# Altium project OctopusPB_r0102.PrjPcb (part 1 of 2)
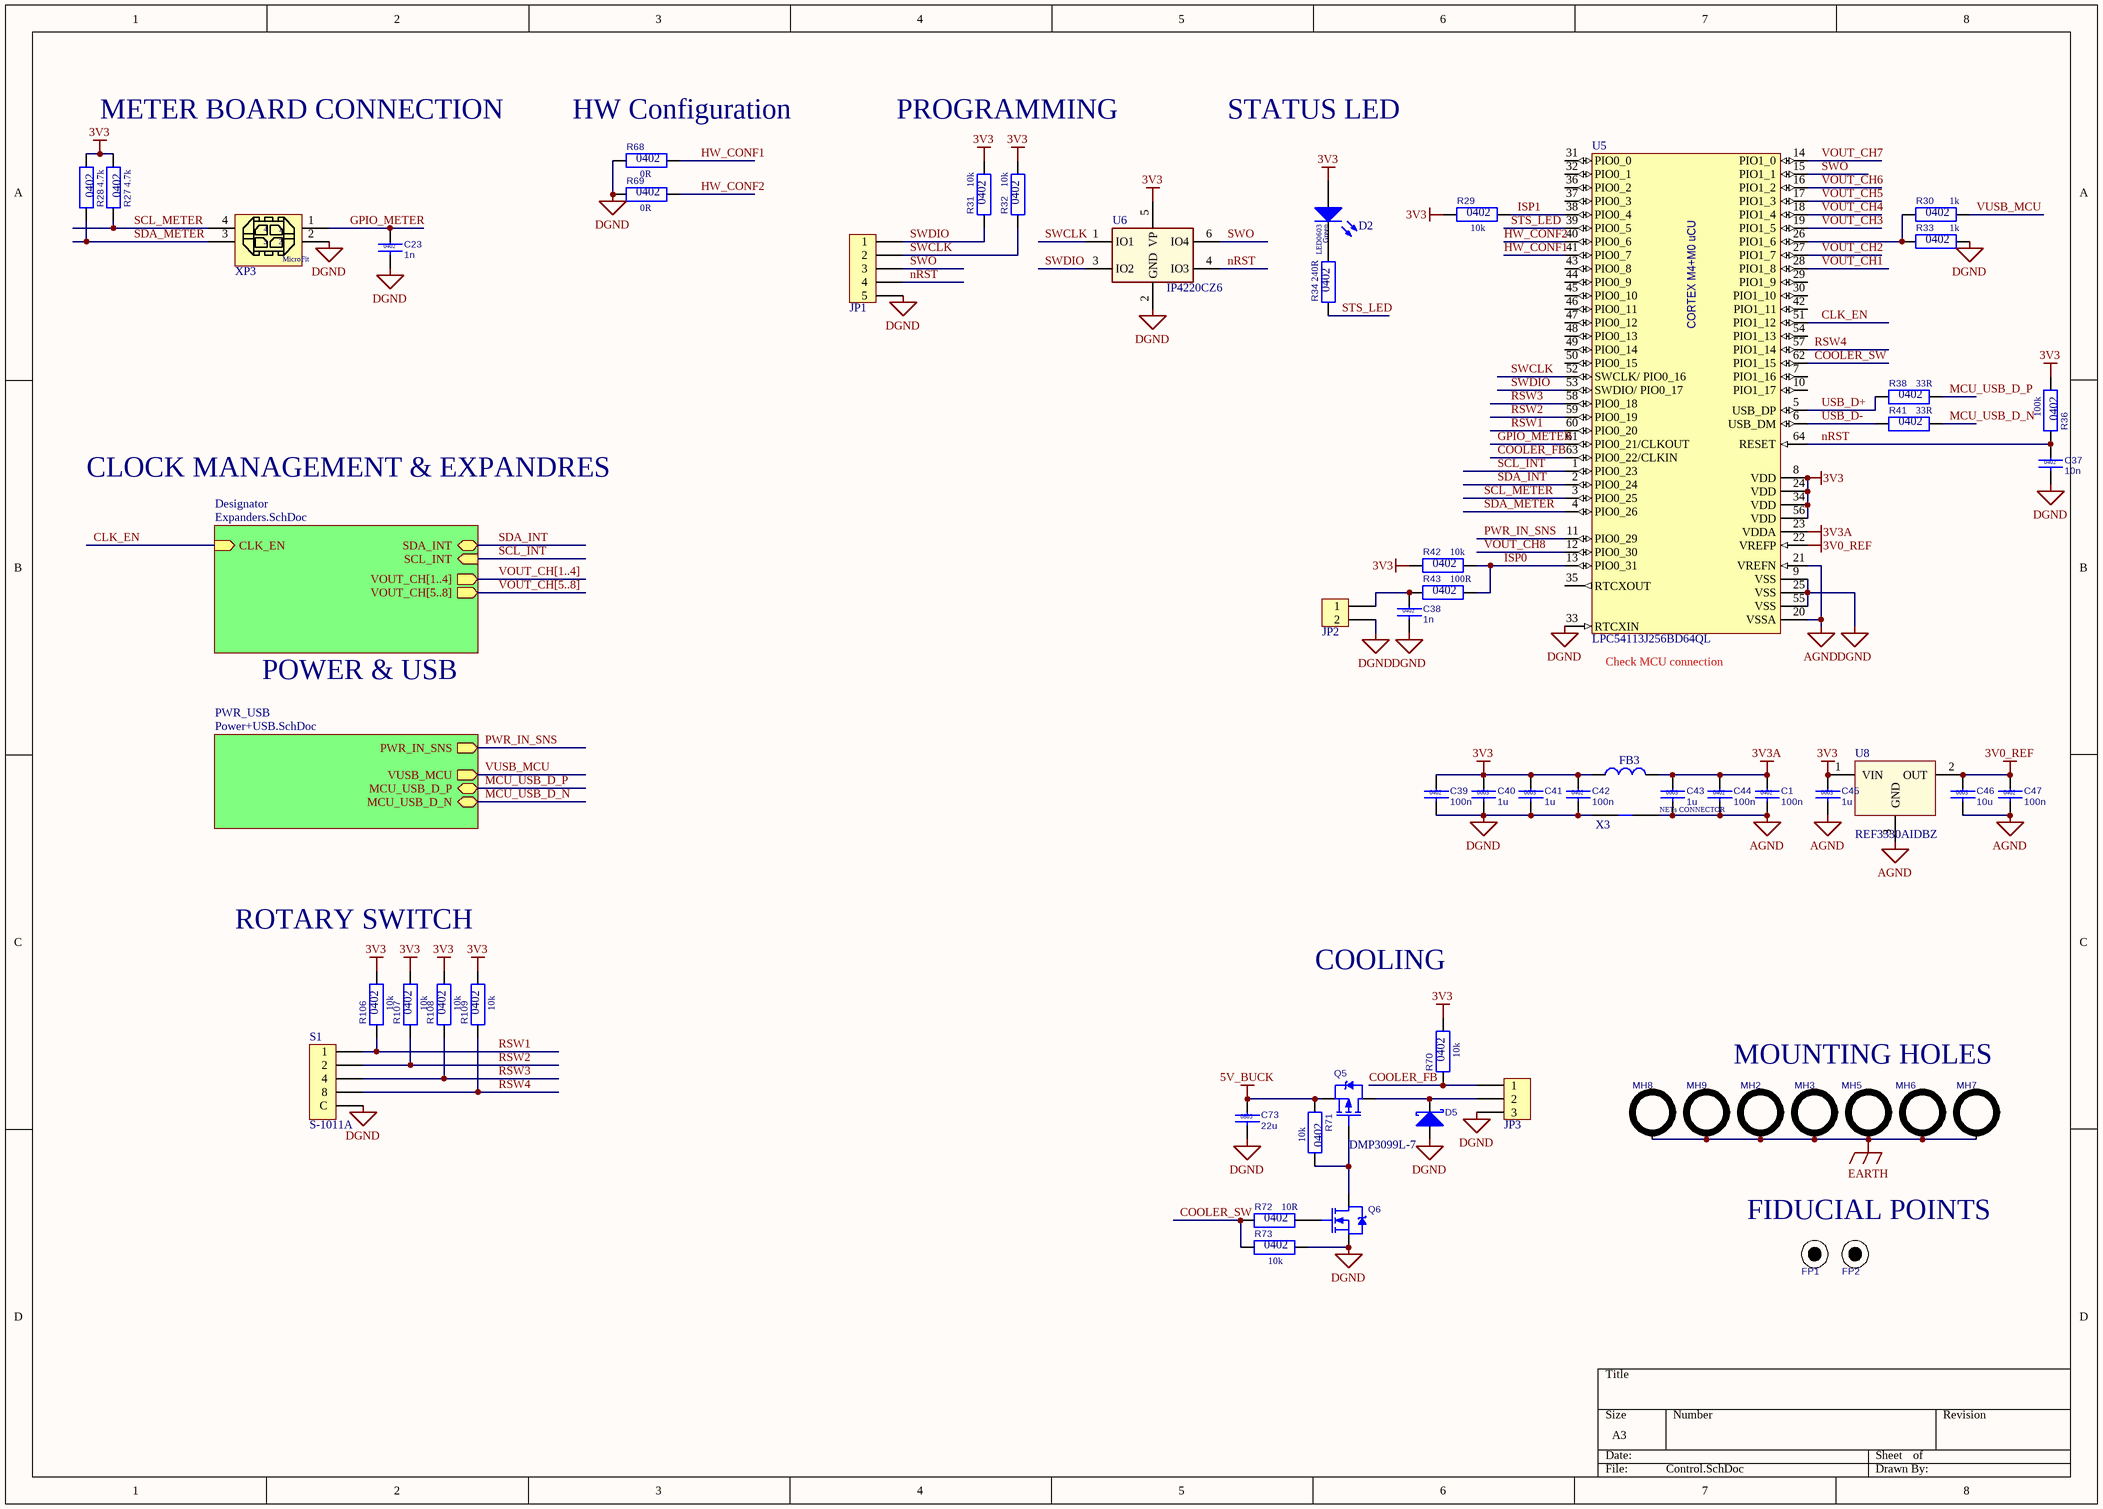
[diagram p0: Control.SchDoc]
5 sheets, 807 parts. Net scope: hierarchical (ports join the sheet entries above them; power ports are global).
Board file: OctopusPB_r0102.PcbDoc
Sheets:
  Control.SchDoc
    Designator = Expanders.SchDoc
      B1 = BuckConverter.SchDoc
      B2 = BuckConverter.SchDoc
      B3 = BuckConverter.SchDoc
      B4 = BuckConverter.SchDoc
      F1 = VoltageFeedbackSwitch.SchDoc
      B5 = BuckConverter.SchDoc
      B6 = BuckConverter.SchDoc
      B7 = BuckConverter.SchDoc
      B8 = BuckConverter.SchDoc
      F2 = VoltageFeedbackSwitch.SchDoc
    PWR_USB = Power+USB.SchDoc

## Sheet Control.SchDoc
size A3

### Parts
C1  100n  Case: 0402  [CC0402M]
C23  1n  Case: 0402  [CC0402M]
C37  10n  Case: 0402  [CC0402M]
C38  1n  Case: 0402  [CC0402M]
C39  100n  Case: 0402  [CC0402M]
C40  1u  Case: 0603  [CC0603M]
C41  1u  Case: 0603  [CC0603M]
C42  100n  Case: 0402  [CC0402M]
C43  1u  Case: 0603  [CC0603M]
C44  100n  Case: 0402  [CC0402M]
C45  1u  Case: 0603  [CC0603M]
C46  10u  Case: 0603  [CC0603M]
C47  100n  Case: 0402  [CC0402M]
C73  22u  Case: 0805  [CC0805M]
D2  Color: Green  [LED0603]  (hidden comment: 150060GS75000)
D5  BAT54HT1G  [SOD323]  (value not drawn)
FB3  BLM18HG102SN1D  [FB0603M]  (value not drawn)
FP1  FP  [FP]  (value not drawn)  (no BOM)
FP2  FP  [FP]  (value not drawn)  (no BOM)
JP1  HEADER-2.54-THR-1x5-MV  [HEADER-2.54-THR-1x5-MV]  (value not drawn)
JP2  HEADER-2.54-THR-1x2-MV  [HEADER-2.54-THR-1x2-MV]  (value not drawn)
JP3  HEADER-2.54-THR-1x3-MV  [HEADER-2.54-THR-1x3-MV]  (value not drawn)
MH2  MH-3.5-PLATED  [MH_3.5_PLATED]  (value not drawn)  (no BOM)
MH3  MH-3.5-PLATED  [MH_3.5_PLATED]  (value not drawn)  (no BOM)
MH5  MH-3.5-PLATED  [MH_3.5_PLATED]  (value not drawn)  (no BOM)
MH6  MH-3.5-PLATED  [MH_3.5_PLATED]  (value not drawn)  (no BOM)
MH7  MH-3.5-PLATED  [MH_3.5_PLATED]  (value not drawn)  (no BOM)
MH8  MH-3.5-PLATED  [MH_3.5_PLATED]  (value not drawn)  (no BOM)
MH9  MH-3.5-PLATED  [MH_3.5_PLATED]  (value not drawn)  (no BOM)
Q5  DMP3099L-7  [SOT23-3]
Q6  NX3020NAKW,115  [SOT323]  (value not drawn)
R27  Case: 0402  [RC0402M]  (hidden comment: 4.7k)
R28  Case: 0402  [RC0402M]  (hidden comment: 4.7k)
R29  Case: 0402  [RC0402M]  (hidden comment: 10k)
R30  Case: 0402  [RC0402M]  (hidden comment: 1k)
R31  Case: 0402  [RC0402M]  (hidden comment: 10k)
R32  Case: 0402  [RC0402M]  (hidden comment: 10k)
R33  Case: 0402  [RC0402M]  (hidden comment: 1k)
R34  Case: 0402  [RC0402M]  (hidden comment: 240R)
R36  Case: 0402  [RC0402M]  (hidden comment: 100k)
R38  Case: 0402  [RC0402M]  (hidden comment: 33R)
R41  Case: 0402  [RC0402M]  (hidden comment: 33R)
R42  Case: 0402  [RC0402M]  (hidden comment: 10k)
R43  Case: 0402  [RC0402M]  (hidden comment: 100R)
R68  Case: 0402  [RC0402M]  (hidden comment: 0R)
R69  Case: 0402  [RC0402M]  (hidden comment: 0R)
R70  Case: 0402  [RC0402M]  (hidden comment: 10k)
R71  Case: 0402  [RC0402M]  (hidden comment: 10k)
R72  Case: 0402  [RC0402M]  (hidden comment: 10R)
R73  Case: 0402  [RC0402M]  (hidden comment: 10k)
R106  Case: 0402  [RC0402M]  (hidden comment: 10k)
R107  Case: 0402  [RC0402M]  (hidden comment: 10k)
R108  Case: 0402  [RC0402M]  (hidden comment: 10k)
R109  Case: 0402  [RC0402M]  (hidden comment: 10k)
S1  S-1011A  [S-1011A]
U5  LPC54113J256BD64QL  [LQFP-64]
U6  IP4220CZ6  [TSOP-6]
U8  REF3330AIDBZ  [SOT23-3]
X3  NETs_CONNECTOR  [NETs_CONNECTOR]  (value not drawn)  (no BOM)
XP3  0447690401  [0447690401]  (value not drawn)

### Sub-sheets
Designator = Expanders.SchDoc: SDA_INT (bidir), SCL_INT (in), VOUT_CH[5..8] (out), CLK_EN (in), VOUT_CH[1..4] (out)
PWR_USB = Power+USB.SchDoc: PWR_IN_SNS (out), MCU_USB_D_N (bidir), MCU_USB_D_P (bidir), VUSB_MCU (out)

### Nets
3V0_REF: C46.1 C47.1 U5.22(VREFP) U8.2(OUT)
3V3: C39.1 C40.1 C41.1 C42.1 C45.1 D2.2(A) FB3.1 R27.2 R28.2 R29.1 R31.2 R32.2 R36.2 R42.1 R70.2 R106.2 R107.2 R108.2 R109.2 U5.8(VDD) U5.24(VDD) U5.34(VDD) U5.56(VDD) U6.5(VP) U8.1(VIN)
3V3A: C1.1 C43.1 C44.1 FB3.2 U5.23(VDDA)
5V_BUCK: C73.1 Q5.2(S) R71.1
AGND: C1.2 C43.2 C44.2 C45.2 C46.2 C47.2 U5.20(VSSA) U5.21(VREFN) U8.3(GND) X3.1
DGND: C23.2 C37.2 C38.2 C39.2 C40.2 C41.2 C42.2 C73.2 D5.2(A) JP1.5 JP2.2 JP3.3 Q6.2(S) R33.2 R68.1 R69.1 R73.2 S1.C U5.9(VSS) U5.25(VSS) U5.33(RTCXIN) U5.55(VSS) U6.2(GND) X3.2 XP3.2
EARTH: MH2.0 MH3.0 MH5.0 MH6.0 MH7.0 MH8.0 MH9.0
CLK_EN: U5.51(PIO1_12) ; sheet Designator/CLK_EN
COOLER_FB: JP3.1 R70.1 U5.63(PIO0_22/CLKIN)
COOLER_SW: R72.1 R73.1 U5.62(PIO1_15)
GPIO_METER: C23.1 U5.61(PIO0_21/CLKOUT) XP3.1
HW_CONF1: R68.2 U5.41(PIO0_7)
HW_CONF2: R69.2 U5.40(PIO0_6)
ISP0: R42.2 R43.2 U5.13(PIO0_31)
ISP1: R29.2 U5.38(PIO0_4)
MCU_USB_D_N: R41.2 ; sheet PWR_USB/MCU_USB_D_N
MCU_USB_D_P: R38.2 ; sheet PWR_USB/MCU_USB_D_P
nRST: C37.1 JP1.4 R36.1 U5.64(RESET) U6.4(IO3)
PWR_IN_SNS: U5.11(PIO0_29) ; sheet PWR_USB/PWR_IN_SNS
RSW1: R106.1 S1.1 U5.60(PIO0_20)
RSW2: R107.1 S1.2 U5.59(PIO0_19)
RSW3: R108.1 S1.4 U5.58(PIO0_18)
RSW4: R109.1 S1.8 U5.57(PIO1_14)
SCL_INT: U5.1(PIO0_23) ; sheet Designator/SCL_INT
SCL_METER: R27.1 U5.3(PIO0_25) XP3.4
SDA_INT: U5.2(PIO0_24) ; sheet Designator/SDA_INT
SDA_METER: R28.1 U5.4(PIO0_26) XP3.3
STS_LED: R34.1 U5.39(PIO0_5)
SWCLK: JP1.2 R32.1 U5.52(SWCLK/_PIO0_16) U6.1(IO1)
SWDIO: JP1.1 R31.1 U5.53(SWDIO/_PIO0_17) U6.3(IO2)
SWO: JP1.3 U5.15(PIO1_1) U6.6(IO4)
USB_D+: R38.1 U5.5(USB_DP)
USB_D-: R41.1 U5.6(USB_DM)
VOUT_CH1: U5.28(PIO1_8)
VOUT_CH2: U5.27(PIO1_7)
VOUT_CH3: U5.19(PIO1_5)
VOUT_CH4: U5.18(PIO1_4)
VOUT_CH5: U5.17(PIO1_3)
VOUT_CH6: U5.16(PIO1_2)
VOUT_CH7: U5.14(PIO1_0)
VOUT_CH8: U5.12(PIO0_30)
VUSB_MCU: R30.2 ; sheet PWR_USB/VUSB_MCU
NetC38_1: C38.1 JP2.1 R43.1
NetD2_1: D2.1(K) R34.2
NetD5_1: D5.1(K) JP3.2 Q5.3(D)
NetQ5_1: Q5.1(G) Q6.3(D) R71.2
NetQ6_1: Q6.1(G) R72.2
NetR30_1: R30.1 R33.1 U5.26(PIO1_6)

Not connected (* = marked no-connect by the designer): U5 7(PIO1_16) 10(PIO1_17) 29(PIO1_9) 30(PIO1_10) 31(PIO0_0) 32(PIO0_1) 35(RTCXOUT) 36(PIO0_2) 37(PIO0_3) 42(PIO1_11) 43(PIO0_8) 44(PIO0_9) 45(PIO0_10) 46(PIO0_11) 47(PIO0_12) 48(PIO0_13) 49(PIO0_14) 50(PIO0_15) 54(PIO1_13)

### Buses and harness runs
bus VOUT_CH[1..4] = sheet Designator/VOUT_CH[1..4]
bus VOUT_CH[5..8] = sheet Designator/VOUT_CH[5..8]

### Notes on the sheet
- METER BOARD CONNECTION
- (near R68) HW Configuration
- PROGRAMMING
- STATUS LED
- CLOCK MANAGEMENT & EXPANDRES
- POWER & USB
- (near U5) Check MCU connection
- ROTARY SWITCH
- COOLING
- MOUNTING HOLES
- FIDUCIAL POINTS
- (in symbol 0447690401) MicroFit
- (in symbol LPC54113J256BD64QL) CORTEX M4+M0 uCU
- (in symbol NETs_CONNECTOR) NETs CONNECTOR

### Library data of the parts
C1 C39 C42 C44 C47 = CC0402K-X7R-25V-100N-M: Chip ceramic capacitor; Manufacturer PN: GRM155R71E104KE14J; Manufacturer: Murata; Tollerance: 10%; Rated Voltage: 25V; Material: X7R; PartNumber: CC0402K-X7R-25V-100N-M; Value: 100n; Publisher: alexey.savchenko; Publishing Date: 1/12/2020
C23 C38 = CC0402K-X7R-50V-1N-M: Chip ceramic capacitor; Manufacturer PN: CC0402KRX7R9BB102; Manufacturer: Yageo; Tollerance: 10%; Rated Voltage: 50V; Material: X7R; PartNumber: CC0402K-X7R-50V-1N-M; Value: 1n; Publisher: alexey.savchenko; Publishing Date: 2/27/2020
C37 = CC0402K-X7R-50V-10N-M: Chip ceramic capacitor; Manufacturer PN: CC0402KRX7R9BB103; Manufacturer: Yageo; Tollerance: 10%; Rated Voltage: 50V; Material: X7R; PartNumber: CC0402K-X7R-50V-10N-M; Value: 10n; Publisher: alexey.savchenko; Publishing Date: 2/27/2020
C40 C41 C43 C45 = CC0603K-X7R-10V-1U-M: Chip ceramic capacitor; Manufacturer PN: CL10B105KP8NNNC; Manufacturer: Samsung; Tollerance: 10%; Rated Voltage: 10V; Material: X5R; PartNumber: CC0603K-X7R-10V-1U-M; Value: 1u; Publisher: alexey.savchenko; Publishing Date: 1/12/2020
C46 = CC0603K-X5R-10V-10U-M: Chip ceramic capacitor; Manufacturer PN: GRM188R61A106KE69D; Manufacturer: Murata; Tollerance: 10%; Rated Voltage: 10V; Material: X5R; PartNumber: CC0603K-X5R-10V-10U-M; Value: 10u; Publisher: alexey.savchenko; Publishing Date: 1/12/2020
C73 = CC0805K-X5R-10V-22U-M: Chip ceramic capacitor; Manufacturer PN: CL21A226KPCLRNC; Manufacturer: Samsung; Tollerance: 10%; Rated Voltage: 10V; Material: X5R; PartNumber: CC0805K-X5R-10V-22U-M; Value: 22u; Publisher: alexey.savchenko; Publishing Date: 2/17/2020
D2 = 150060GS75000: LED GREEN CLEAR 0603 SMD; Manufacturer: Würth Elektronik; Case: LED0603; PartNumber: 150060GS75000; Manufacturer PN: 150060GS75000; Publisher: alexey.savchenko; Publishing Date: 1/27/2020
D5 = BAT54HT1G: DIODE SCHOTTKY 30V 200MA SOD323; Manufacturer: ON Semiconductor; PartNumber: BAT54HT1G; Manufacturer PN: BAT54HT1G; Case: SOD323; Publisher: alexey.savchenko; Publishing Date: 2/17/2020
FB3 = BLM18HG102SN1D: FERRITE BEAD 1 KOHM 0603 1LN; Manufacturer: Murata; Resistance: 1000; PartNumber: BLM18HG102SN1D; Manufacturer PN: BLM18HG102SN1D; Publisher: alexey.savchenko; Publishing Date: 1/12/2020
FP1 FP2 = FP: No BOM component to short circuit 2 nets; Manufacturer PN: NULL; PartNumber: FP; Manufacturer: NULL; Publisher: alexey.savchenko; Publishing Date: 2/14/2020
JP1 = HEADER-2.54-THR-1x5-MV: Header Connector, 2.54mm pitch, Single, 5 contacts, Male, Vertical; Manufacturer PN: PH1-05-UA; Manufacturer: Adam Tech; PartNumber: HEADER-2.54-THR-1x5-MV; Publisher: alexey.savchenko; Publishing Date: 1/24/2020
JP2 = HEADER-2.54-THR-1x2-MV: Header Connector, 2.54mm pitch, Single, 2 contacts, Male, Vertical; Manufacturer PN: PH1-02-UA; Manufacturer: Adam Tech; PartNumber: HEADER-2.54-THR-1x2-MV; Publisher: alexey.savchenko; Publishing Date: 1/24/2020
JP3 = HEADER-2.54-THR-1x3-MV: Header Connector, 2.54mm pitch, Single, 3 contacts, Male, Vertical; Manufacturer PN: PH1-03-UA; Manufacturer: Adam Tech; PartNumber: HEADER-2.54-THR-1x3-MV; Publisher: alexey.savchenko; Publishing Date: 1/24/2020
MH2 MH3 MH5-MH9 = MH-3.5-PLATED: Mounting Hole; Manufacturer PN: NULL; PartNumber: MH-3.5-PLATED; Manufacturer: NULL; Publisher: alexey.savchenko; Publishing Date: 3/25/2020
Q5 = DMP3099L-7: P-Channel 30V 3.8A (Ta) 1.08W (Ta) Surface Mount SOT-23; Manufacturer: Diodes; PartNumber: DMP3099L-7; Manufacturer PN: DMP3099L-7; Case: SOT23-3; Publisher: alexey.savchenko; Publishing Date: 2/26/2020
Q6 = NX3020NAKW,115: MOSFET N-CH 30V 180MA SOT323; Manufacturer: Nexperia; Analogs: DMN63D8LW-7; PartNumber: NX3020NAKW,115; Manufacturer PN: NX3020NAKW,115; Case: SOT323; Publisher: alexey.savchenko; Publishing Date: 2/17/2020
R27 R28 = RC0402F-4K7-M: Chip resistor; Manufacturer PN: RC0402FR-074K7L; Manufacturer: Yageo; Tollerance: 1%; Rated Voltage: 50V; Power: 0.063W; T Coefficient: 100ppm; Value: 4.7k; PartNumber: RC0402F-4K7-M; Publisher: alexey.savchenko; Publishing Date: 2/24/2020
R29 R31 R32 R42 R70 R71 R73 R106-R109 = RC0402F-10K-M: Chip resistor; Manufacturer PN: RC0402FR-0710KL; Manufacturer: Yageo; Tollerance: 1%; Rated Voltage: 50V; Power: 0.063W; T Coefficient: 100ppm; Value: 10k; PartNumber: RC0402F-10K-M; Publisher: alexey.savchenko; Publishing Date: 2/24/2020
R30 R33 = RC0402F-1K-M: Chip resistor; Manufacturer PN: RC0402FR-071KL; Manufacturer: Yageo; Tollerance: 1%; Rated Voltage: 50V; Power: 0.063W; T Coefficient: 100ppm; Value: 1k; PartNumber: RC0402F-1K-M; Publisher: alexey.savchenko; Publishing Date: 2/24/2020
R34 = RC0402F-240R-M: Chip resistor; Manufacturer PN: RC0402FR-07240RL; Manufacturer: Yageo; Tollerance: 1%; Rated Voltage: 50V; Power: 0.063W; Value: 240R; PartNumber: RC0402F-240R-M; Publisher: alexey.savchenko; Publishing Date: 2/24/2020
R36 = RC0402F-100K-M: Chip resistor; Manufacturer PN: RC0402FR-07100KL; Manufacturer: Yageo; Tollerance: 1%; Rated Voltage: 50V; Power: 0.063W; T Coefficient: 100ppm; Value: 100k; PartNumber: RC0402F-100K-M; Publisher: alexey.savchenko; Publishing Date: 2/24/2020
R38 R41 = RC0402F-33R-M: Chip resistor; Manufacturer PN: RC0402FR-0733RL; Manufacturer: Yageo; Tollerance: 1%; Rated Voltage: 50V; Power: 0.063W; Value: 33R; PartNumber: RC0402F-33R-M; Publisher: alexey.savchenko; Publishing Date: 2/24/2020
R43 = RC0402F-100R-M: Chip resistor; Manufacturer PN: RC0402FR-07100RL; Manufacturer: Yageo; Tollerance: 1%; Rated Voltage: 50V; Power: 0.063W; Value: 100R; PartNumber: RC0402F-100R-M; Publisher: alexey.savchenko; Publishing Date: 2/24/2020
R68 R69 = RC0402F-0R-M: Chip resistor; Manufacturer PN: RC0402FR-070RL; Manufacturer: Yageo; Tollerance: 1%; Rated Voltage: 50V; Power: 0.063W; Value: 0R; PartNumber: RC0402F-0R-M; Publisher: alexey.savchenko; Publishing Date: 2/24/2020
R72 = RC0402F-10R-M: Chip resistor; Manufacturer PN: RC0402FR-0710RL; Manufacturer: Yageo; Tollerance: 1%; Rated Voltage: 50V; Power: 0.063W; Value: 10R; PartNumber: RC0402F-10R-M; Publisher: alexey.savchenko; Publishing Date: 2/24/2020
S1 = S-1011A: Dip Switch Hexadecimal 16 Position Through Hole, Right Angle Rotary for Tool Actuator 100mA 5VDC; Manufacturer PN: DSC6001CI2A-004.0000S-1011A; Manufacturer: Nidec Copal Electronics; PartNumber: S-1011A; Publisher: alexey.savchenko; Publishing Date: 4/17/2020
U5 = LPC54113J256BD64QL: IC MCU 32BIT 256KB FLASH 64LQFP; Manufacturer: NXP; PartNumber: LPC54113J256BD64QL; Manufacturer PN: LPC54113J256BD64QL; Case: LQFP-64; Publisher: alexey.savchenko; Publishing Date: 1/24/2020
U6 = IP4220CZ6: TVS DIODE 5.5V 6TSOP; Manufacturer: Nexperia; PartNumber: IP4220CZ6; Manufacturer PN: IP4220CZ6; Case: TSOP-6; Publisher: alexey.savchenko; Publishing Date: 1/24/2020
U8 = REF3330AIDBZ: IC VREF SERIES 0.15% SOT23-3; Manufacturer: TI; PartNumber: REF3330AIDBZ; Manufacturer PN: REF3330AIDBZ; Case: SOT23-3; Publisher: alexey.savchenko; Publishing Date: 2/19/2020
X3 = NETs_CONNECTOR: No BOM component to short circuit 2 nets; Manufacturer PN: NULL; PartNumber: NETs_CONNECTOR; Manufacturer: NULL; Publisher: alexey.savchenko; Publishing Date: 2/14/2020
XP3 = 0447690401: Micro-Fit BMI Receptacle Header, Dual Row, Vertical, with Press-fit Plastic Pegs, 2.54µm Tin (Sn), 4 Circuits; Manufacturer: Molex; Analogs: 0447690402, 0447690403; PartNumber: 0447690401; Manufacturer PN: 0447690401; Publisher: alexey.savchenko; Publishing Date: 2/14/2020

## Sheet Expanders.SchDoc
size A2
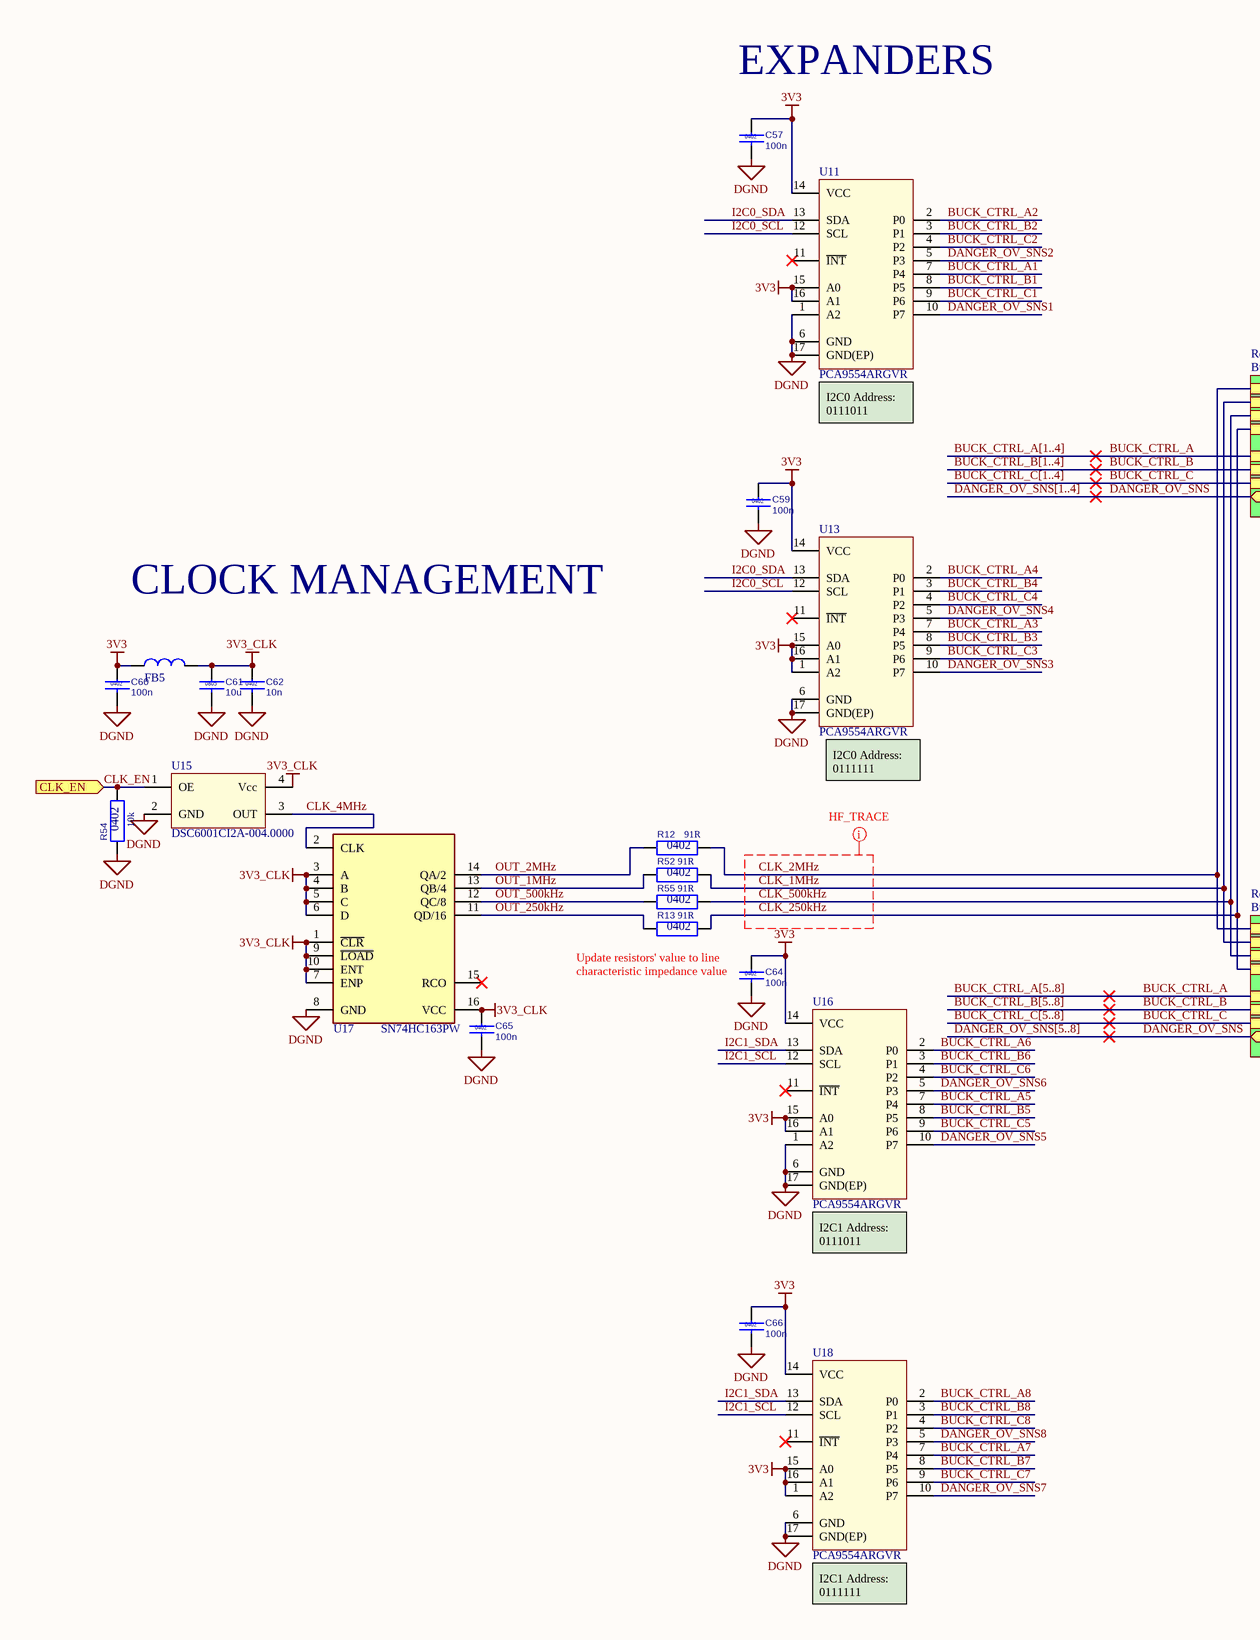
[diagram p1: Expanders.SchDoc, left]
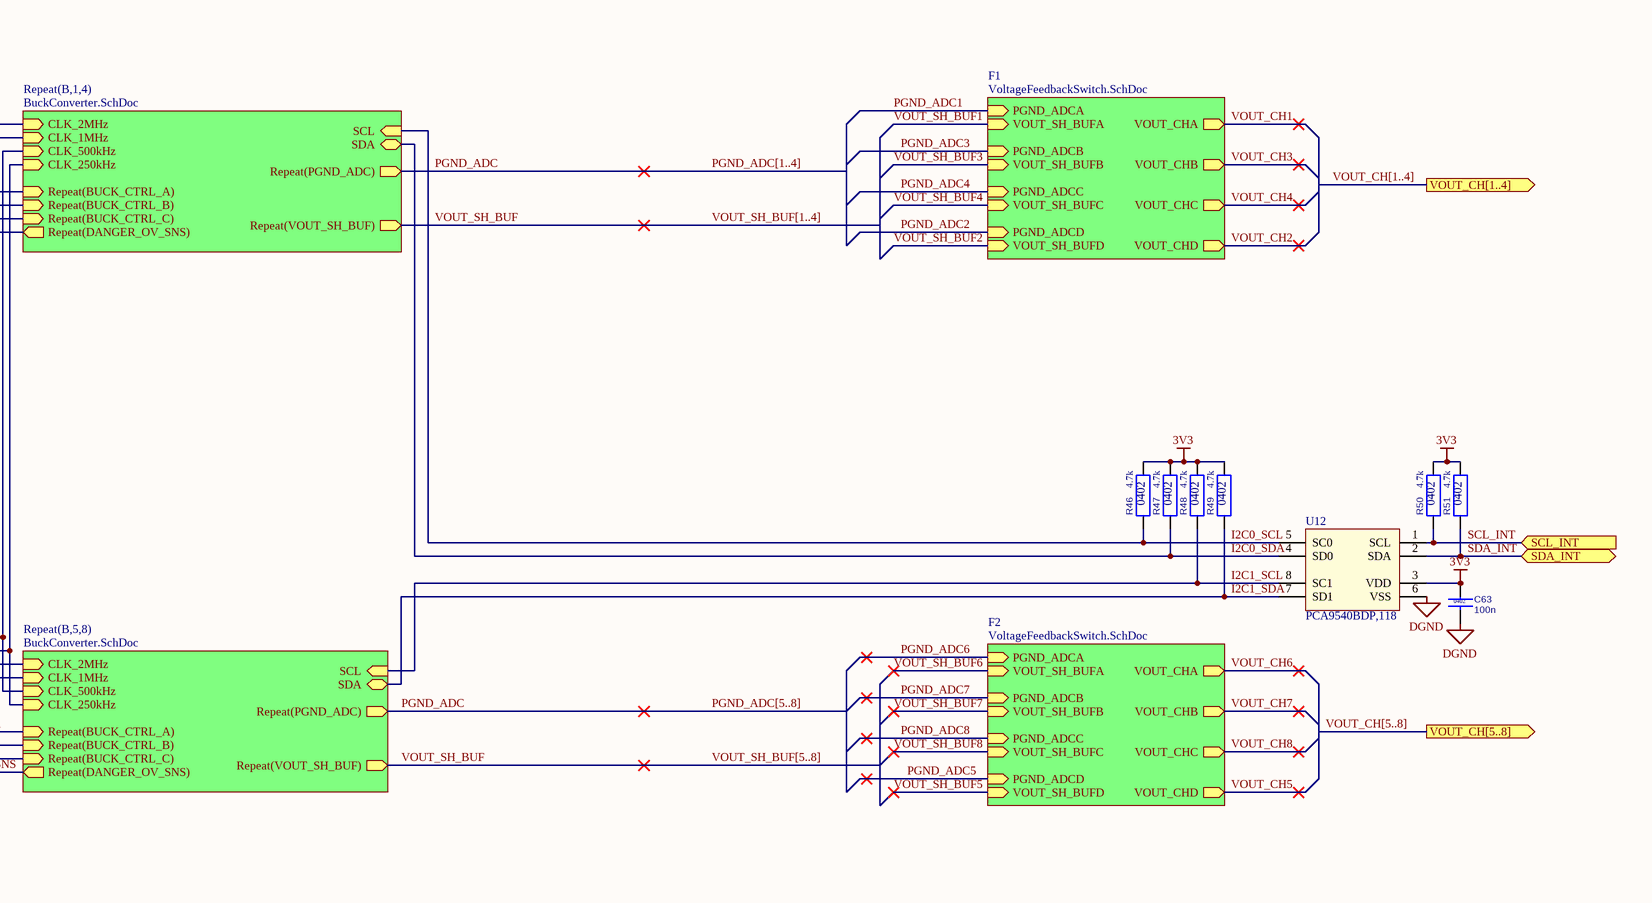
[diagram p2: Expanders.SchDoc, right]

### Parts
C57  100n  Case: 0402  [CC0402M]
C59  100n  Case: 0402  [CC0402M]
C60  100n  Case: 0402  [CC0402M]
C61  10u  Case: 0805  [CC0805M]
C62  10n  Case: 0402  [CC0402M]
C63  100n  Case: 0402  [CC0402M]
C64  100n  Case: 0402  [CC0402M]
C65  100n  Case: 0402  [CC0402M]
C66  100n  Case: 0402  [CC0402M]
FB5  BLM18HG102SN1D  [FB0603M]  (value not drawn)
R12  Case: 0402  [RC0402M]  (hidden comment: 91R)
R13  Case: 0402  [RC0402M]  (hidden comment: 91R)
R46  Case: 0402  [RC0402M]  (hidden comment: 4.7k)
R47  Case: 0402  [RC0402M]  (hidden comment: 4.7k)
R48  Case: 0402  [RC0402M]  (hidden comment: 4.7k)
R49  Case: 0402  [RC0402M]  (hidden comment: 4.7k)
R50  Case: 0402  [RC0402M]  (hidden comment: 4.7k)
R51  Case: 0402  [RC0402M]  (hidden comment: 4.7k)
R52  Case: 0402  [RC0402M]  (hidden comment: 91R)
R54  Case: 0402  [RC0402M]  (hidden comment: 10k)
R55  Case: 0402  [RC0402M]  (hidden comment: 91R)
U11  PCA9554ARGVR  [VQFN-16(RGV)]
U12  PCA9540BDP,118  [TSSOP-8]
U13  PCA9554ARGVR  [VQFN-16(RGV)]
U15  DSC6001CI2A-004.0000  [CDFN3225-4LD]
U16  PCA9554ARGVR  [VQFN-16(RGV)]
U17  SN74HC163PW  [TSSOP-16]
U18  PCA9554ARGVR  [VQFN-16(RGV)]

### Sub-sheets
F1 = VoltageFeedbackSwitch.SchDoc: PGND_ADCD (in), VOUT_SH_BUFD (in), PGND_ADCB (in), VOUT_SH_BUFB (in), VOUT_CHD (out), VOUT_SH_BUFC (in), PGND_ADCC (in), VOUT_CHA (out), PGND_ADCA (in), VOUT_SH_BUFA (in), VOUT_CHC (out), VOUT_CHB (out)
F2 = VoltageFeedbackSwitch.SchDoc: PGND_ADCD (in), VOUT_SH_BUFD (in), PGND_ADCB (in), VOUT_SH_BUFB (in), VOUT_CHD (out), VOUT_SH_BUFC (in), PGND_ADCC (in), VOUT_CHA (out), PGND_ADCA (in), VOUT_SH_BUFA (in), VOUT_CHC (out), VOUT_CHB (out)
Repeat(B,1,4) = BuckConverter.SchDoc: CLK_1MHz (in), SDA (bidir), SCL (in), CLK_500kHz (in), Repeat(BUCK_CTRL_C) (in), Repeat(BUCK_CTRL_B) (in), Repeat(BUCK_CTRL_A) (in), Repeat(DANGER_OV_SNS) (out), Repeat(PGND_ADC) (out), Repeat(VOUT_SH_BUF) (out), CLK_250kHz (in), CLK_2MHz (in)
Repeat(B,5,8) = BuckConverter.SchDoc: CLK_1MHz (in), SDA (bidir), SCL (in), CLK_500kHz (in), Repeat(BUCK_CTRL_C) (in), Repeat(BUCK_CTRL_B) (in), Repeat(BUCK_CTRL_A) (in), Repeat(DANGER_OV_SNS) (out), Repeat(PGND_ADC) (out), Repeat(VOUT_SH_BUF) (out), CLK_250kHz (in), CLK_2MHz (in)

### Ports
CLK_EN (in), SCL_INT (in), SDA_INT (bidir), VOUT_CH[1..4] (out), VOUT_CH[5..8] (out)

### Nets
3V3: C57.1 C59.1 C60.1 C63.1 C64.1 C66.1 FB5.1 R46.2 R47.2 R48.2 R49.2 R50.2 R51.2 U11.14(VCC) U11.15(A0) U11.16(A1) U12.3(VDD) U13.1(A2) U13.14(VCC) U13.15(A0) U13.16(A1) U16.14(VCC) U16.15(A0) U16.16(A1) U18.1(A2) U18.14(VCC) U18.15(A0) U18.16(A1)
3V3_CLK: C61.1 C62.1 C65.1 FB5.2 U15.4(Vcc) U17.1(~{CLR}) U17.3(A) U17.4(B) U17.5(C) U17.6(D) U17.7(ENP) U17.9(~{LOAD}) U17.10(ENT) U17.16(VCC)
DGND: C57.2 C59.2 C60.2 C61.2 C62.2 C63.2 C64.2 C65.2 C66.2 R54.1 U11.1(A2) U11.6(GND) U11.17(GND(EP)) U12.6(VSS) U13.6(GND) U13.17(GND(EP)) U15.2(GND) U16.1(A2) U16.6(GND) U16.17(GND(EP)) U17.8(GND) U18.6(GND) U18.17(GND(EP))
BUCK_CTRL_A: sheet Repeat(B,1,4)/Repeat(BUCK_CTRL_A), sheet Repeat(B,5,8)/Repeat(BUCK_CTRL_A)
BUCK_CTRL_A1: U11.7(P4)
BUCK_CTRL_A2: U11.2(P0)
BUCK_CTRL_A3: U13.7(P4)
BUCK_CTRL_A4: U13.2(P0)
BUCK_CTRL_A5: U16.7(P4)
BUCK_CTRL_A6: U16.2(P0)
BUCK_CTRL_A7: U18.7(P4)
BUCK_CTRL_A8: U18.2(P0)
BUCK_CTRL_B: sheet Repeat(B,1,4)/Repeat(BUCK_CTRL_B), sheet Repeat(B,5,8)/Repeat(BUCK_CTRL_B)
BUCK_CTRL_B1: U11.8(P5)
BUCK_CTRL_B2: U11.3(P1)
BUCK_CTRL_B3: U13.8(P5)
BUCK_CTRL_B4: U13.3(P1)
BUCK_CTRL_B5: U16.8(P5)
BUCK_CTRL_B6: U16.3(P1)
BUCK_CTRL_B7: U18.8(P5)
BUCK_CTRL_B8: U18.3(P1)
BUCK_CTRL_C: sheet Repeat(B,1,4)/Repeat(BUCK_CTRL_C), sheet Repeat(B,5,8)/Repeat(BUCK_CTRL_C)
BUCK_CTRL_C1: U11.9(P6)
BUCK_CTRL_C2: U11.4(P2)
BUCK_CTRL_C3: U13.9(P6)
BUCK_CTRL_C4: U13.4(P2)
BUCK_CTRL_C5: U16.9(P6)
BUCK_CTRL_C6: U16.4(P2)
BUCK_CTRL_C7: U18.9(P6)
BUCK_CTRL_C8: U18.4(P2)
CLK_1MHz: R52.2 ; sheet Repeat(B,1,4)/CLK_1MHz, sheet Repeat(B,5,8)/CLK_1MHz
CLK_2MHz: R12.2 ; sheet Repeat(B,1,4)/CLK_2MHz, sheet Repeat(B,5,8)/CLK_2MHz
CLK_4MHz: U15.3(OUT) U17.2(CLK)
CLK_250kHz: R13.2 ; sheet Repeat(B,1,4)/CLK_250kHz, sheet Repeat(B,5,8)/CLK_250kHz
CLK_500kHz: R55.2 ; sheet Repeat(B,1,4)/CLK_500kHz, sheet Repeat(B,5,8)/CLK_500kHz
CLK_EN: R54.2 U15.1(OE) ; port CLK_EN
DANGER_OV_SNS: sheet Repeat(B,1,4)/Repeat(DANGER_OV_SNS), sheet Repeat(B,5,8)/Repeat(DANGER_OV_SNS)
DANGER_OV_SNS1: U11.10(P7)
DANGER_OV_SNS2: U11.5(P3)
DANGER_OV_SNS3: U13.10(P7)
DANGER_OV_SNS4: U13.5(P3)
DANGER_OV_SNS5: U16.10(P7)
DANGER_OV_SNS6: U16.5(P3)
DANGER_OV_SNS7: U18.10(P7)
DANGER_OV_SNS8: U18.5(P3)
I2C0_SCL: R46.1 U11.12(SCL) U12.5(SC0) U13.12(SCL) ; sheet Repeat(B,1,4)/SCL
I2C0_SDA: R47.1 U11.13(SDA) U12.4(SD0) U13.13(SDA) ; sheet Repeat(B,1,4)/SDA
I2C1_SCL: R48.1 U12.8(SC1) U16.12(SCL) U18.12(SCL) ; sheet Repeat(B,5,8)/SCL
I2C1_SDA: R49.1 U12.7(SD1) U16.13(SDA) U18.13(SDA) ; sheet Repeat(B,5,8)/SDA
OUT_1MHz: R52.1 U17.13(QB/4)
OUT_2MHz: R12.1 U17.14(QA/2)
OUT_250kHz: R13.1 U17.11(QD/16)
OUT_500kHz: R55.1 U17.12(QC/8)
PGND_ADC: sheet Repeat(B,1,4)/Repeat(PGND_ADC), sheet Repeat(B,5,8)/Repeat(PGND_ADC)
SCL_INT: R50.1 U12.1(SCL) ; port SCL_INT
SDA_INT: R51.1 U12.2(SDA) ; port SDA_INT
VOUT_SH_BUF: sheet Repeat(B,1,4)/Repeat(VOUT_SH_BUF), sheet Repeat(B,5,8)/Repeat(VOUT_SH_BUF)

Not connected (* = marked no-connect by the designer): U11 11(~{INT})*; U13 11(~{INT})*; U16 11(~{INT})*; U17 15(RCO)*; U18 11(~{INT})*

### Buses and harness runs
bus BUCK_CTRL_A[1..4]
bus BUCK_CTRL_A[5..8]
bus BUCK_CTRL_B[1..4]
bus BUCK_CTRL_B[5..8]
bus BUCK_CTRL_C[1..4]
bus BUCK_CTRL_C[5..8]
bus DANGER_OV_SNS[1..4]
bus DANGER_OV_SNS[5..8]
bus PGND_ADC[1..4]
bus PGND_ADC[5..8]
bus VOUT_CH[1..4] = port VOUT_CH[1..4]
bus VOUT_CH[5..8] = port VOUT_CH[5..8]
bus VOUT_SH_BUF[1..4]
bus VOUT_SH_BUF[5..8]

### Layout directives
net class HF_TRACE: CLK_1MHz, CLK_2MHz, CLK_250kHz, CLK_500kHz

### Notes on the sheet
- (near C57) EXPANDERS
- (near U11) I2C0 Address:
  0111011
- CLOCK MANAGEMENT
- (near U13) I2C0 Address:
  0111111
- Update resistors' value to line characteristic impedance value
- (near U16) I2C1 Address:
  0111011
- (near U18) I2C1 Address:
  0111111

### Library data of the parts
C57 C59 C60 C63-C66 = CC0402K-X7R-25V-100N-M: as C1 on sheet Control; PartNumber: CC0402K-X7R-25V-100N-M; Value: 100n; Publisher: alexey.savchenko; Publishing Date: 1/12/2020
C61 = CC0805K-X7R-6V3-10U-M: Chip ceramic capacitor; Manufacturer PN: CL21B106KQQNNNG; Manufacturer: Samsung; Tollerance: 10%; Rated Voltage: 6.3V; Material: X7R; PartNumber: CC0805K-X7R-6V3-10U-M; Value: 10u; Publisher: alexey.savchenko; Publishing Date: 2/17/2020
C62 = CC0402K-X7R-50V-10N-M: as C37 on sheet Control; PartNumber: CC0402K-X7R-50V-10N-M; Value: 10n; Publisher: alexey.savchenko; Publishing Date: 2/27/2020
FB5 = BLM18HG102SN1D: as FB3 on sheet Control; PartNumber: BLM18HG102SN1D; Manufacturer PN: BLM18HG102SN1D; Publisher: alexey.savchenko; Publishing Date: 1/12/2020
R12 R13 R52 R55 = RC0402F-91R-M: Chip resistor; Manufacturer PN: RC0402FR-0791RL; Manufacturer: Yageo; Tollerance: 1%; Rated Voltage: 50V; Power: 0.063W; Value: 91R; PartNumber: RC0402F-91R-M; Publisher: alexey.savchenko; Publishing Date: 2/24/2020
R46-R51 = RC0402F-4K7-M: as R27 on sheet Control; Value: 4.7k; PartNumber: RC0402F-4K7-M; Publisher: alexey.savchenko; Publishing Date: 2/24/2020
R54 = RC0402F-10K-M: as R29 on sheet Control; Value: 10k; PartNumber: RC0402F-10K-M; Publisher: alexey.savchenko; Publishing Date: 2/24/2020
U11 U13 U16 U18 = PCA9554ARGVR: I/O Expander 8 I²C, SMBus 400kHz 16-VQFN (4x4); Manufacturer: TI; Analogs: NXP has same chip; PartNumber: PCA9554ARGVR; Manufacturer PN: PCA9554ARGVR; Case: VQFN-16(RGV); Publisher: alexey.savchenko; Publishing Date: 2/26/2020
U12 = PCA9540BDP,118: IC INTERFACE SPECIALIZED 8TSSOP; Manufacturer: NXP; PartNumber: PCA9540BDP,118; Manufacturer PN: PCA9540BDP,118; Case: TSSOP-8; Publisher: alexey.savchenko; Publishing Date: 1/24/2020
U15 = DSC6001CI2A-004.0000: 4MHz XO (Standard) CMOS Oscillator 1.8V ~ 3.3V Enable/Disable 4-SMD, No Lead; Manufacturer: Microchip; PartNumber: DSC6001CI2A-004.0000; Manufacturer PN: DSC6001CI2A-004.0000; Frequency: 4MHz; Publisher: alexey.savchenko; Publishing Date: 3/6/2020
U17 = SN74HC163PW: Counter IC Binary Counter 1 Element 4 Bit Positive Edge 16-TSSOP; Manufacturer: TI; PartNumber: SN74HC163PW; Manufacturer PN: SN74HC163PW; Case: TSSOP-16; Publisher: alexey.savchenko; Publishing Date: 3/6/2020

## Sheet BuckConverter.SchDoc
size A2; DrawnBy: Alexey Savchenko; Organization: Ring; Revision: 1.0
Used 8 times, as channels Designator/B1, Designator/B2, Designator/B3, Designator/B4, Designator/B5, Designator/B6, Designator/B7, Designator/B8. Parts and nets are listed once, with the designators drawn on the sheet.
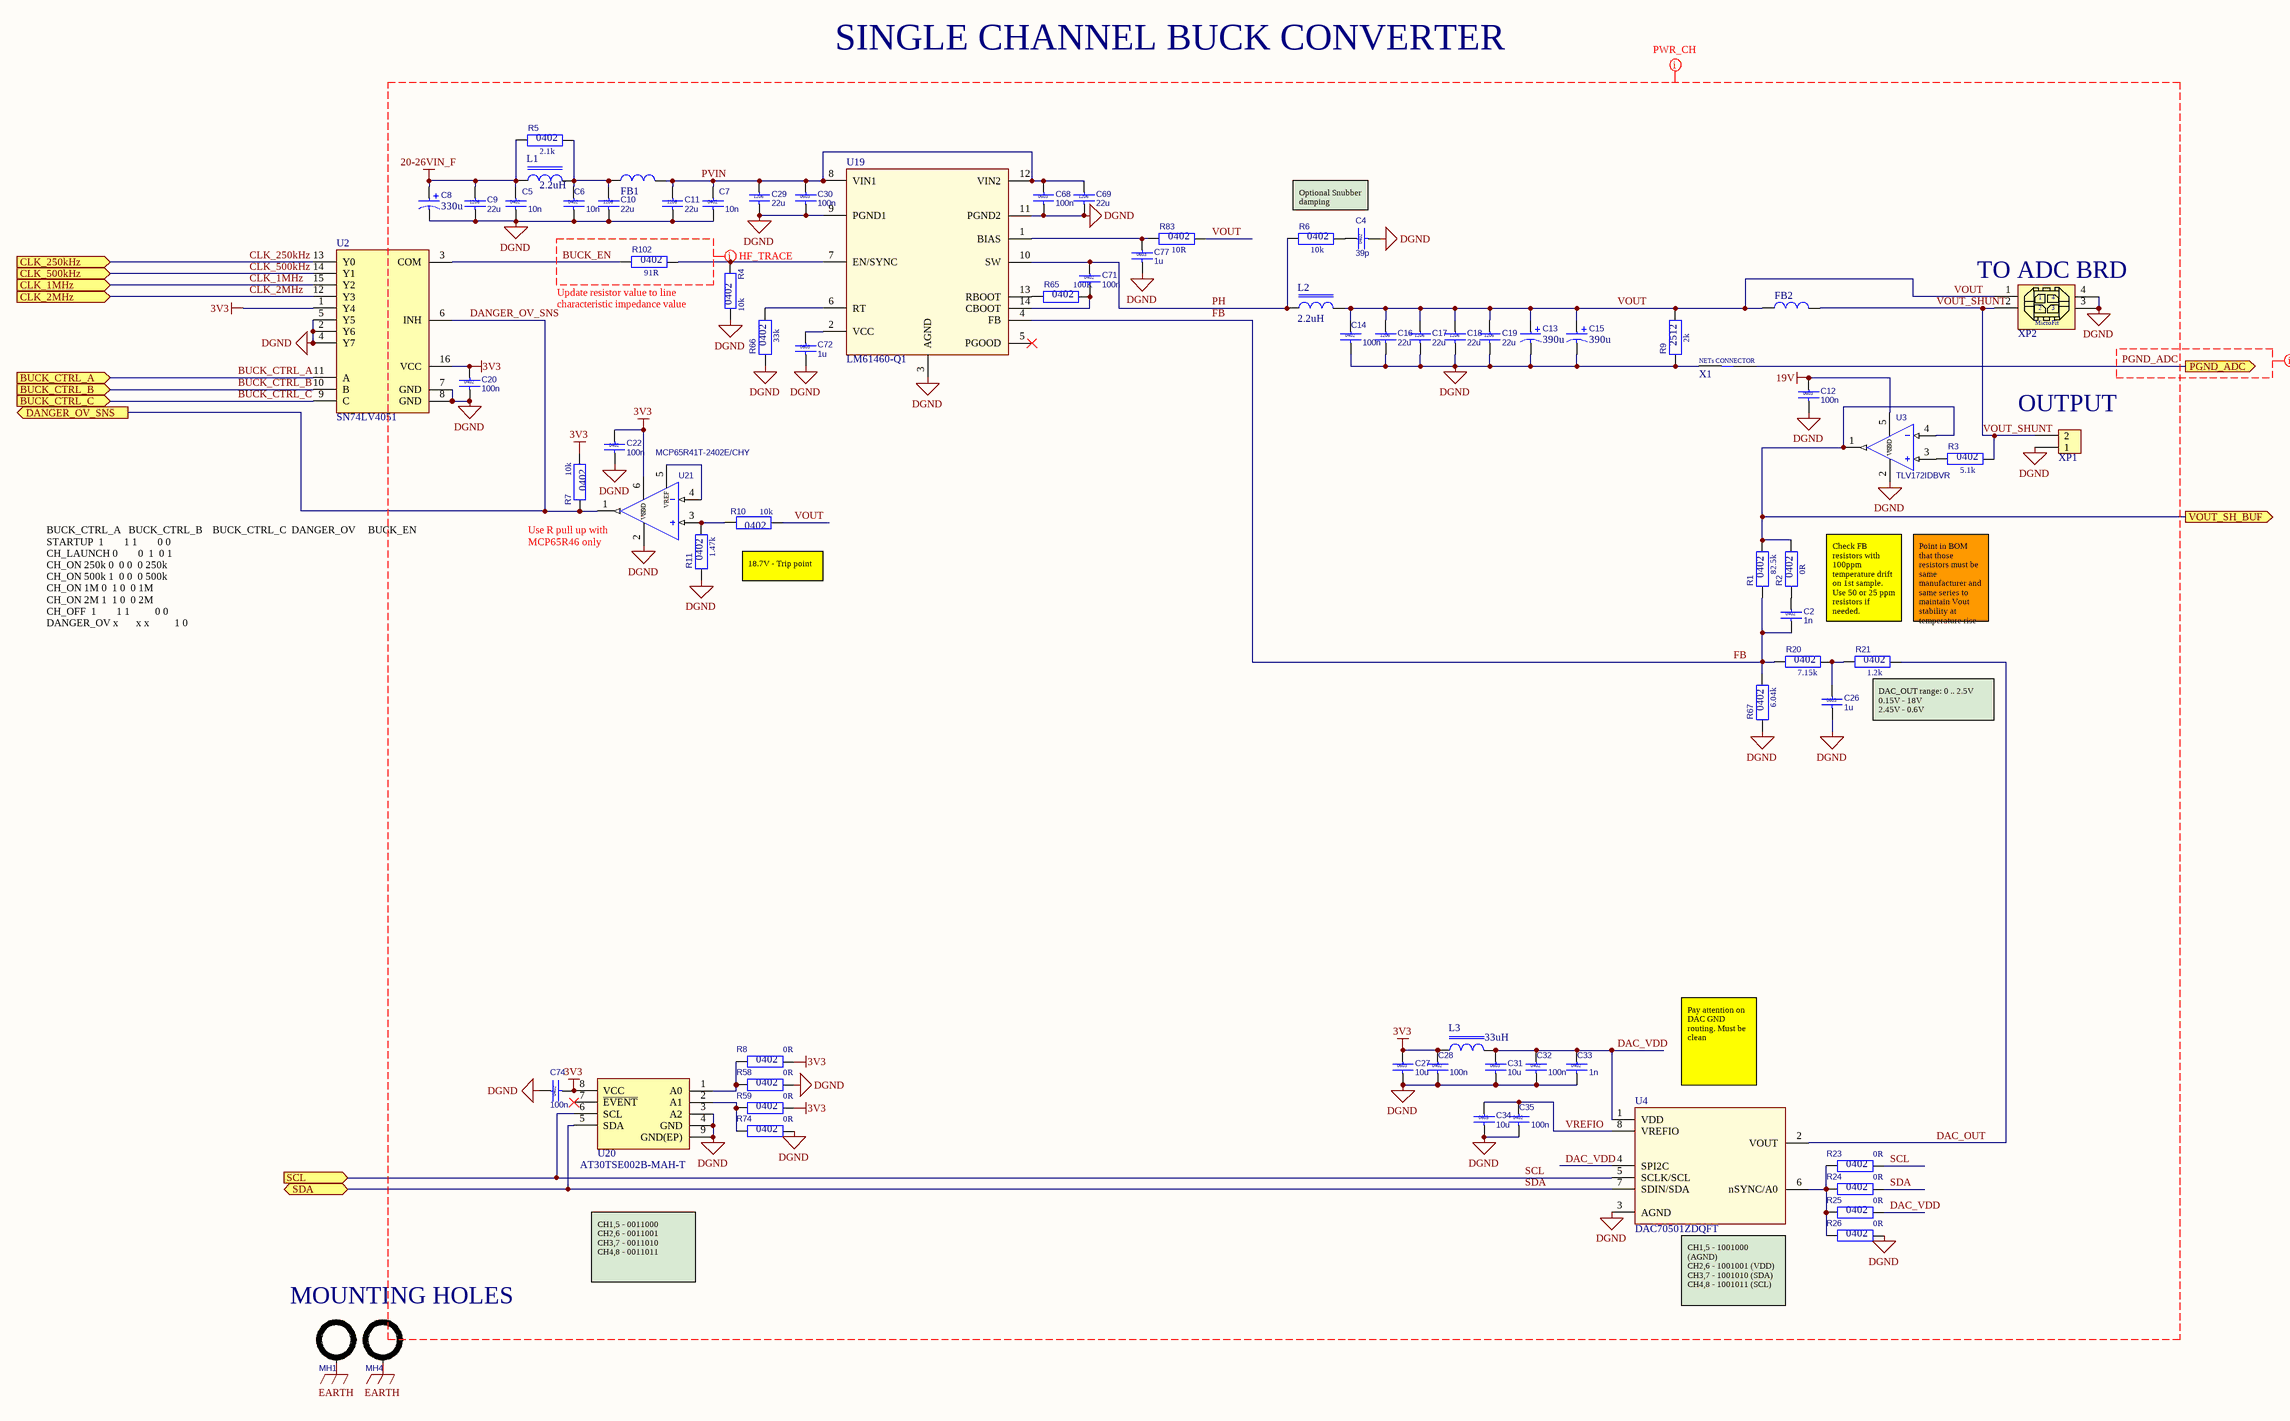
[diagram p3: BuckConverter.SchDoc]

### Parts
C2  1n  Case: 0402  [CC0402M]
C4  39p  Case: 0402  [CC0402M]
C5  10n  Case: 0402  [CC0603M]
C6  10n  Case: 0402  [CC0603M]
C7  10n  Case: 0402  [CC0603M]
C8  330u  [CA-D10H10.5-SMD]
C9  22u  Case: 1206  [CC1206M]
C10  22u  Case: 1206  [CC1206M]
C11  22u  Case: 1206  [CC1206M]
C12  100n  Case: 0603  [CC0603M]
C13  390u  [CA-D10H13P5.0-THR]
C14  100n  Case: 0402  [CC0402M]
C15  390u  [CA-D10H13P5.0-THR]
C16  22u  Case: 1206  [CC1206M]
C17  22u  Case: 1206  [CC1206M]
C18  22u  Case: 1206  [CC1206M]
C19  22u  Case: 1206  [CC1206M]
C20  100n  Case: 0402  [CC0402M]
C22  100n  Case: 0402  [CC0402M]
C26  1u  Case: 0603  [CC0603M]
C27  10u  Case: 0603  [CC0603M]
C28  100n  Case: 0402  [CC0402M]
C29  22u  Case: 1206  [CC1206M]
C30  100n  Case: 0603  [CC0603M]
C31  10u  Case: 0603  [CC0603M]
C32  100n  Case: 0402  [CC0402M]
C33  1n  Case: 0402  [CC0402M]
C34  10u  Case: 0603  [CC0603M]
C35  100n  Case: 0402  [CC0402M]
C68  100n  Case: 0603  [CC0603M]
C69  22u  Case: 1206  [CC1206M]
C71  100n  Case: 0402  [CC0402M]
C72  1u  Case: 0603  [CC0603M]
C74  100n  Case: 0402  [CC0402M]
C77  1u  Case: 0603  [CC0603M]
FB1  BLM21SP601SH1D  [FB0805M]  (value not drawn)
FB2  BLM18KG260TN1D  [FB0603M]  (value not drawn)
L1  2.2uH  [MGV252010S]
L2  2.2uH  [104CDMCCDS]
L3  33uH  [IC0805-M]
MH1  MH-3.5-PLATED  [MH_3.5_PLATED]  (value not drawn)  (no BOM)
MH4  MH-3.5-PLATED  [MH_3.5_PLATED]  (value not drawn)  (no BOM)
R1  Case: 0402  [RC0402M]  (hidden comment: 82.5k)
R2  Case: 0402  [RC0402M]  (hidden comment: 0R)
R3  Case: 0402  [RC0402M]  (hidden comment: 5.1k)
R4  Case: 0402  [RC0402M]  (hidden comment: 10k)
R5  Case: 0402  [RC0402M]  (hidden comment: 2.1k)
R6  Case: 0402  [RC0402M]  (hidden comment: 10k)
R7  Case: 0402  [RC0402M]  (hidden comment: 10k)
R8  Case: 0402  [RC0402M]  (hidden comment: 0R)
R9  Case: 2512  [RC2512M]  (hidden comment: 2k)
R10  Case: 0402  [RC0402M]  (hidden comment: 10k)
R11  Case: 0402  [RC0402M]  (hidden comment: 1.47k)
R20  Case: 0402  [RC0402M]  (hidden comment: 7.15k)
R21  Case: 0402  [RC0402M]  (hidden comment: 1.2k)
R23  Case: 0402  [RC0402M]  (hidden comment: 0R)
R24  Case: 0402  [RC0402M]  (hidden comment: 0R)
R25  Case: 0402  [RC0402M]  (hidden comment: 0R)
R26  Case: 0402  [RC0402M]  (hidden comment: 0R)
R58  Case: 0402  [RC0402M]  (hidden comment: 0R)
R59  Case: 0402  [RC0402M]  (hidden comment: 0R)
R65  Case: 0402  [RC0402M]  (hidden comment: 100R)
R66  Case: 0402  [RC0402M]  (hidden comment: 33k)
R67  Case: 0402  [RC0402M]  (hidden comment: 6.04k)
R74  Case: 0402  [RC0402M]  (hidden comment: 0R)
R83  Case: 0402  [RC0402M]  (hidden comment: 10R)
R102  Case: 0402  [RC0402M]  (hidden comment: 91R)
U2  SN74LV4051  [TSSOP-16]
U3  TLV172IDBVR  [SOT23-5]
U4  DAC70501ZDQFT  [WSON-8]
U19  LM61460-Q1  [VQFN-HR-14]
U20  AT30TSE002B-MAH-T  [WDFN-8]
U21  MCP65R41T-2402E/CHY  [SOT23-6]
X1  NETs_CONNECTOR  [NETs_CONNECTOR]  (value not drawn)  (no BOM)
XP1  TBH-2x3.81P-RA-GN  [TBH-2x3.81P-RA-GN]  (value not drawn)
XP2  0447690401  [0447690401]  (value not drawn)

### Ports
BUCK_CTRL_A (in), BUCK_CTRL_B (in), BUCK_CTRL_C (in), CLK_1MHz (in), CLK_2MHz (in), CLK_250kHz (in), CLK_500kHz (in), DANGER_OV_SNS (out), PGND_ADC (out), SCL (in), SDA (bidir), VOUT_SH_BUF (out)

### Nets
3V3: C20.1 C22.1 C27.1 C28.1 C74.2 L3.1 R7.2 R8.2 R59.2 U2.1(Y4) U2.16(VCC) U20.8(VCC) U21.6(VDD)
19V: C12.1 U3.5(VDD)
20-26VIN_F: C5.1 C8.1 C9.1 L1.1 R5.1
DGND: C4.2 C5.2 C6.2 C7.2 C8.2 C9.2 C10.2 C11.2 C12.2 C13.2 C14.2 C15.2 C16.2 C17.2 C18.2 C19.2 C20.2 C22.2 C26.2 C27.2 C28.2 C29.2 C30.2 C31.2 C32.2 C33.2 C34.2 C35.2 C68.2 C69.2 C72.2 C74.1 C77.2 R4.2 R9.1 R11.1 R26.2 R58.2 R66.1 R67.1 R74.2 U2.2(Y6) U2.4(Y7) U2.5(Y5) U2.7(GND) U2.8(GND) U3.2(VSS) U4.3(AGND) U19.3(AGND) U19.9(PGND1) U19.11(PGND2) U20.3(A2) U20.4(GND) U20.9(GND(EP)) U21.2(VSS) X1.1 XP1.1 XP2.3 XP2.4
EARTH: MH1.0 MH4.0
BUCK_CTRL_A: U2.11(A) ; port BUCK_CTRL_A
BUCK_CTRL_B: U2.10(B) ; port BUCK_CTRL_B
BUCK_CTRL_C: U2.9(C) ; port BUCK_CTRL_C
BUCK_EN: R102.1 U2.3(COM)
CLK_1MHz: U2.15(Y2) ; port CLK_1MHz
CLK_2MHz: U2.12(Y3) ; port CLK_2MHz
CLK_250kHz: U2.13(Y0) ; port CLK_250kHz
CLK_500kHz: U2.14(Y1) ; port CLK_500kHz
DAC_OUT: R21.2 U4.2(VOUT)
DAC_VDD: C31.1 C32.1 C33.1 L3.2 R25.2 U4.1(VDD) U4.4(SPI2C)
DANGER_OV_SNS: R7.1 U2.6(INH) U21.1(OUT1) ; port DANGER_OV_SNS
FB: C2.2 R1.1 R20.1 R67.2 U19.4(FB)
PGND_ADC: X1.2 ; port PGND_ADC
PH: C71.1 L2.1 R6.1 U19.10(SW)
PVIN: C7.1 C11.1 C29.1 C30.1 C68.1 C69.1 FB1.2 U19.8(VIN1) U19.12(VIN2)
SCL: R23.2 U4.5(SCLK/SCL) U20.6(SCL) ; port SCL
SDA: R24.2 U4.7(SDIN/SDA) U20.5(SDA) ; port SDA
VOUT: C13.1 C14.1 C15.1 C16.1 C17.1 C18.1 C19.1 FB2.1 L2.2 R9.2 R10.2 R83.2 XP2.1
VOUT_SH_BUF: R1.2 R2.2 U3.1(OUT1) U3.4(IN1-) ; port VOUT_SH_BUF
VOUT_SHUNT: FB2.2 R3.2 XP1.2 XP2.2
VREFIO: C34.1 C35.1 U4.8(VREFIO)
NetC2_1: C2.1 R2.1
NetC4_1: C4.1 R6.2
NetC6_1: C6.1 C10.1 FB1.1 L1.2 R5.2
NetC26_1: C26.1 R20.2 R21.1
NetC71_2: C71.2 R65.2 U19.14(CBOOT)
NetC72_1: C72.1 U19.2(VCC)
NetC77_1: C77.1 R83.1 U19.1(BIAS)
NetR3_1: R3.1 U3.3(IN1+)
NetR4_1: R4.1 R102.2 U19.7(EN/SYNC)
NetR8_1: R8.1 R58.1 U20.1(A0)
NetR10_1: R10.1 R11.2 U21.3(IN1+)
NetR23_1: R23.1 R24.1 R25.1 R26.1 U4.6(nSYNC/A0)
NetR59_1: R59.1 R74.1 U20.2(A1)
NetR65_1: R65.1 U19.13(RBOOT)
NetR66_2: R66.2 U19.6(RT)
NetU21_4: U21.4(IN1-) U21.5(VREF)

Not connected (* = marked no-connect by the designer): U19 5(PGOOD)*; U20 7(~{EVENT})*

### Channels
Designator/B1: designators end in _B1; ports BUCK_CTRL_A=BUCK_CTRL_A1 BUCK_CTRL_B=BUCK_CTRL_B1 BUCK_CTRL_C=BUCK_CTRL_C1 CLK_1MHz=CLK_1MHz CLK_2MHz=CLK_2MHz CLK_250kHz=CLK_250kHz CLK_500kHz=CLK_500kHz DANGER_OV_SNS=DANGER_OV_SNS1 PGND_ADC=PGND_ADC1 SCL=I2C0_SCL SDA=I2C0_SDA VOUT_SH_BUF=VOUT_SH_BUF1
Designator/B2: designators end in _B2; ports BUCK_CTRL_A=BUCK_CTRL_A2 BUCK_CTRL_B=BUCK_CTRL_B2 BUCK_CTRL_C=BUCK_CTRL_C2 CLK_1MHz=CLK_1MHz CLK_2MHz=CLK_2MHz CLK_250kHz=CLK_250kHz CLK_500kHz=CLK_500kHz DANGER_OV_SNS=DANGER_OV_SNS2 PGND_ADC=PGND_ADC2 SCL=I2C0_SCL SDA=I2C0_SDA VOUT_SH_BUF=VOUT_SH_BUF2
Designator/B3: designators end in _B3; ports BUCK_CTRL_A=BUCK_CTRL_A3 BUCK_CTRL_B=BUCK_CTRL_B3 BUCK_CTRL_C=BUCK_CTRL_C3 CLK_1MHz=CLK_1MHz CLK_2MHz=CLK_2MHz CLK_250kHz=CLK_250kHz CLK_500kHz=CLK_500kHz DANGER_OV_SNS=DANGER_OV_SNS3 PGND_ADC=PGND_ADC3 SCL=I2C0_SCL SDA=I2C0_SDA VOUT_SH_BUF=VOUT_SH_BUF3
Designator/B4: designators end in _B4; ports BUCK_CTRL_A=BUCK_CTRL_A4 BUCK_CTRL_B=BUCK_CTRL_B4 BUCK_CTRL_C=BUCK_CTRL_C4 CLK_1MHz=CLK_1MHz CLK_2MHz=CLK_2MHz CLK_250kHz=CLK_250kHz CLK_500kHz=CLK_500kHz DANGER_OV_SNS=DANGER_OV_SNS4 PGND_ADC=PGND_ADC4 SCL=I2C0_SCL SDA=I2C0_SDA VOUT_SH_BUF=VOUT_SH_BUF4
Designator/B5: designators end in _B5; ports BUCK_CTRL_A=BUCK_CTRL_A5 BUCK_CTRL_B=BUCK_CTRL_B5 BUCK_CTRL_C=BUCK_CTRL_C5 CLK_1MHz=CLK_1MHz CLK_2MHz=CLK_2MHz CLK_250kHz=CLK_250kHz CLK_500kHz=CLK_500kHz DANGER_OV_SNS=DANGER_OV_SNS5 PGND_ADC=PGND_ADC5 SCL=I2C1_SCL SDA=I2C1_SDA VOUT_SH_BUF=VOUT_SH_BUF5
Designator/B6: designators end in _B6; ports BUCK_CTRL_A=BUCK_CTRL_A6 BUCK_CTRL_B=BUCK_CTRL_B6 BUCK_CTRL_C=BUCK_CTRL_C6 CLK_1MHz=CLK_1MHz CLK_2MHz=CLK_2MHz CLK_250kHz=CLK_250kHz CLK_500kHz=CLK_500kHz DANGER_OV_SNS=DANGER_OV_SNS6 PGND_ADC=PGND_ADC6 SCL=I2C1_SCL SDA=I2C1_SDA VOUT_SH_BUF=VOUT_SH_BUF6
Designator/B7: designators end in _B7; ports BUCK_CTRL_A=BUCK_CTRL_A7 BUCK_CTRL_B=BUCK_CTRL_B7 BUCK_CTRL_C=BUCK_CTRL_C7 CLK_1MHz=CLK_1MHz CLK_2MHz=CLK_2MHz CLK_250kHz=CLK_250kHz CLK_500kHz=CLK_500kHz DANGER_OV_SNS=DANGER_OV_SNS7 PGND_ADC=PGND_ADC7 SCL=I2C1_SCL SDA=I2C1_SDA VOUT_SH_BUF=VOUT_SH_BUF7
Designator/B8: designators end in _B8; ports BUCK_CTRL_A=BUCK_CTRL_A8 BUCK_CTRL_B=BUCK_CTRL_B8 BUCK_CTRL_C=BUCK_CTRL_C8 CLK_1MHz=CLK_1MHz CLK_2MHz=CLK_2MHz CLK_250kHz=CLK_250kHz CLK_500kHz=CLK_500kHz DANGER_OV_SNS=DANGER_OV_SNS8 PGND_ADC=PGND_ADC8 SCL=I2C1_SCL SDA=I2C1_SDA VOUT_SH_BUF=VOUT_SH_BUF8

### Layout directives
net class PWR_CH: 3V3, 19V, 20-26VIN_F, BUCK_EN, DAC_OUT, DAC_VDD, DANGER_OV_SNS, DGND, FB, PGND_ADC, PH, PVIN, SCL, SDA, VOUT, VOUT_SHUNT, VREFIO
net class PGND_ADC: PGND_ADC
net class HF_TRACE: BUCK_EN

### Notes on the sheet
- SINGLE CHANNEL BUCK CONVERTER
- Optional Snubber damping
- (near XP2) TO ADC BRD
- Update resistor value to line characteristic impedance value
- (near XP1) OUTPUT
- (near U21) Use R pull up with MCP65R46 only
- 18.7V - Trip point
- BUCK_CTRL_A   BUCK_CTRL_B    BUCK_CTRL_C  DANGER_OV     BUCK_EN
  STARTUP		1	      	1	1	      	0	0
  CH_LAUNCH	0	      	0 	1		0	1
  CH_ON 250k	0		0	0		0	250k
  CH_ON 500k	1		0	0		0	500k
  CH_ON 1M	0		1	0		0	1M
  CH_ON 2M	1		1	0		0	2M
  CH_OFF		1	      	1	1	        	0	0
  DANGER_OV	x	     	x	x	        	1	0
- Check FB resistors with 100ppm temperature drift on 1st sample. Use 50 or 25 ppm resistors if needed.
- Point in BOM that those resistors must be same manufacturer and same series to maintain Vout stability at temperature rise
- (near R21) DAC_OUT range: 0 .. 2.5V
  0.15V - 18V
  2.45V - 0.6V
- (near U4) Pay attention on DAC GND routing. Must be clean
- CH1,5 - 0011000
  CH2,6 - 0011001
  CH3,7 - 0011010
  CH4,8 - 0011011
- MOUNTING HOLES
- (near U4) CH1,5 - 1001000 (AGND)
  CH2,6 - 1001001 (VDD)
  CH3,7 - 1001010 (SDA)
  CH4,8 - 1001011 (SCL)
- (in symbol 0447690401) MicroFit
- (in symbol NETs_CONNECTOR) NETs CONNECTOR

### Library data of the parts
C2 C33 = CC0402K-X7R-50V-1N-M: as C23 on sheet Control; PartNumber: CC0402K-X7R-50V-1N-M; Value: 1n; Publisher: alexey.savchenko; Publishing Date: 2/27/2020
C4 = CC0402J-NP0-50V-39P-M: Chip ceramic capacitor; Manufacturer PN: CC0402JRNPO9BN390; Manufacturer: Yageo; Tollerance: 5%; Rated Voltage: 50V; Material: NP0; PartNumber: CC0402J-NP0-50V-39P-M; Value: 39p; Publisher: alexey.savchenko; Publishing Date: 2/27/2020
C5-C7 = CC0402K-X7R-50V-10N-M: as C37 on sheet Control; PartNumber: CC0402K-X7R-50V-10N-M; Value: 10n; Publisher: alexey.savchenko; Publishing Date: 2/27/2020
C8 = CE-L10D10-330U-35V-SMD: Aluminium Electrlytic capacitor; Manufacturer PN: EXV337M035A9PAA; Manufacturer: Kemet; Tollerance: 20%; Rated Voltage: 35V; ESR: 120m; Value: 330u; PartNumber: CE-L10D10-330U-35V-SMD; Publisher: alexey.savchenko; Publishing Date: 3/30/2020
C9-C11 C29 C69 = CC1206K-X5R-35V-22U-M: Chip ceramic capacitor; Manufacturer PN: C3216X5R1V226M160AC; Manufacturer: TDK; Tollerance: 10%; Rated Voltage: 35V; Material: X5R; PartNumber: CC1206K-X5R-35V-22U-M; Value: 22u; Publisher: alexey.savchenko; Publishing Date: 3/30/2020
C12 C30 C68 = CC0603K-X7R-50V-100N-M: Chip ceramic capacitor; Manufacturer PN: CC0603KRX7R9BB104; Manufacturer: Yageo; Tollerance: 10%; Rated Voltage: 50V; Material: X7R; PartNumber: CC0603K-X7R-50V-100N-M; Value: 100n; Publisher: alexey.savchenko; Publishing Date: 1/12/2020
C13 C15 = APSG250ELL391MJB5S: Aluminium polymer capacitor; Manufacturer: United Chemi-Con; Tollerance: 20%; Rated Voltage: 20V; ESR: 14m; Value: 390u; PartNumber: APSG250ELL391MJB5S; Manufacturer PN: APSG250ELL391MJB5S; Publisher: alexey.savchenko; Publishing Date: 12/10/2020
C14 C20 C22 C28 C32 C35 C71 C74 = CC0402K-X7R-25V-100N-M: as C1 on sheet Control; PartNumber: CC0402K-X7R-25V-100N-M; Value: 100n; Publisher: alexey.savchenko; Publishing Date: 1/12/2020
C16-C19 = CC1206K-X5R-25V-22U-M: Chip ceramic capacitor; Manufacturer PN: CL31A226KAHNNNE; Manufacturer: Samsung; Tollerance: 10%; Rated Voltage: 25V; Material: X5R; PartNumber: CC1206K-X5R-25V-22U-M; Value: 22u; Publisher: alexey.savchenko; Publishing Date: 1/12/2020
C26 = CC0603K-X7R-10V-1U-M: as C40 on sheet Control; PartNumber: CC0603K-X7R-10V-1U-M; Value: 1u; Publisher: alexey.savchenko; Publishing Date: 1/12/2020
C27 C31 C34 = CC0603K-X5R-10V-10U-M: as C46 on sheet Control; PartNumber: CC0603K-X5R-10V-10U-M; Value: 10u; Publisher: alexey.savchenko; Publishing Date: 1/12/2020
C72 C77 = CC0603K-X5R-50V-1U-M: Chip ceramic capacitor; Manufacturer PN: CL10A105KB8NNNC; Manufacturer: Samsung; Tollerance: 10%; Rated Voltage: 50V; Material: X5R; PartNumber: CC0603K-X5R-50V-1U-M; Value: 1u; Publisher: alexey.savchenko; Publishing Date: 1/12/2020
FB1 = BLM21SP601SH1D: 600 Ohms @ 100MHz 1 Power Line Ferrite Bead 0805 (2012 Metric) 2.3A; Manufacturer: Murata; Resistance: 600; PartNumber: BLM21SP601SH1D; Manufacturer PN: BLM21SP601SH1D; Publisher: alexey.savchenko; Publishing Date: 2/17/2020
FB2 = BLM18KG260TN1D: 26 Ohms @ 100MHz 1 Power Line Ferrite Bead 0603 (1608 Metric) 6A 7mOhm; Manufacturer: Murata; Resistance: 26; PartNumber: BLM18KG260TN1D; Manufacturer PN: BLM18KG260TN1D; Publisher: alexey.savchenko; Publishing Date: 1/12/2020
L1 = MGV252010S2R2M-10: 2.2µH Shielded Molded Inductor 2.4A 110mOhm Max 1008 (2520 Metric); Manufacturer: Laird-Signal Integrity Products; Tollerance: 20%; PartNumber: MGV252010S2R2M-10; Manufacturer PN: MGV252010S2R2M-10; Value: 2.2uH; Publisher: alexey.savchenko; Publishing Date: 4/1/2020
L2 = 104CDMCCDS-2R2MC: FIXED IND 2.2UH 15A 7 MOHM; Manufacturer: Sumida; Tollerance: 20%; PartNumber: 104CDMCCDS-2R2MC; Manufacturer PN: 104CDMCCDS-2R2MC; Value: 2.2uH; Publisher: alexey.savchenko; Publishing Date: 1/12/2020
L3 = CV201210-330K: FIXED IND 33UH 5MA 1.25 OHM SMD; Manufacturer: Bourns; Tollerance: 10%; PartNumber: CV201210-330K; Manufacturer PN: CV201210-330K; Value: 33uH; Publisher: alexey.savchenko; Publishing Date: 2/17/2020
MH1 MH4 = MH-3.5-PLATED: Mounting Hole; Manufacturer PN: NULL; PartNumber: MH-3.5-PLATED; Manufacturer: NULL; Publisher: alexey.savchenko; Publishing Date: 3/25/2020
R1 = RC0402F-82K5-M: Chip resistor; Manufacturer PN: RC0402FR-0782K5L; Manufacturer: Yageo; Tollerance: 1%; Rated Voltage: 50V; Power: 0.063W; T Coefficient: 100ppm; Value: 82.5k; PartNumber: RC0402F-82K5-M; Publisher: alexey.savchenko; Publishing Date: 12/7/2020
R2 R8 R23-R26 R58 R59 R74 = RC0402F-0R-M: as R68 on sheet Control; Value: 0R; PartNumber: RC0402F-0R-M; Publisher: alexey.savchenko; Publishing Date: 2/24/2020
R3 = RC0402F-5K1-M: Chip resistor; Manufacturer PN: RC0402FR-075K1L; Manufacturer: Yageo; Tollerance: 1%; Rated Voltage: 50V; Power: 0.063W; T Coefficient: 100ppm; Value: 5.1k; PartNumber: RC0402F-5K1-M; Publisher: alexey.savchenko; Publishing Date: 2/24/2020
R4 R6 R7 R10 = RC0402F-10K-M: as R29 on sheet Control; Value: 10k; PartNumber: RC0402F-10K-M; Publisher: alexey.savchenko; Publishing Date: 2/24/2020
R5 = RC0402F-2K1-M: Chip resistor; Manufacturer PN: RC0402FR-072K1L; Manufacturer: Yageo; Tollerance: 1%; Rated Voltage: 50V; Power: 0.063W; T Coefficient: 100ppm; Value: 2.1k; PartNumber: RC0402F-2K1-M; Publisher: alexey.savchenko; Publishing Date: 2/24/2020
R9 = RC2512J-2K0-M: Chip resistor; Manufacturer PN: RMCF2512JT2K00; Manufacturer: Stackpole; Tollerance: 5%; Rated Voltage: 200V; Power: 1W; T Coefficient: 200ppm; Value: 2k; PartNumber: RC2512J-2K0-M; Publisher: alexey.savchenko; Publishing Date: 12/7/2020
R11 = RC0402F-1K47-M: Chip resistor; Manufacturer PN: RC0402FR-071K47L; Manufacturer: Yageo; Tollerance: 1%; Rated Voltage: 50V; Power: 0.063W; T Coefficient: 100ppm; Value: 1.47k; PartNumber: RC0402F-1K47-M; Publisher: alexey.savchenko; Publishing Date: 12/10/2020
R20 = RC0402F-7K15-M: Chip resistor; Manufacturer PN: RC0402FR-077K15L; Manufacturer: Yageo; Tollerance: 1%; Rated Voltage: 50V; Power: 0.063W; T Coefficient: 100ppm; Value: 7.15k; PartNumber: RC0402F-7K15-M; Publisher: alexey.savchenko; Publishing Date: 2/24/2020
R21 = RC0402F-1K2-M: Chip resistor; Manufacturer PN: RC0402FR-071K2L; Manufacturer: Yageo; Tollerance: 1%; Rated Voltage: 50V; Power: 0.063W; T Coefficient: 100ppm; Value: 1.2k; PartNumber: RC0402F-1K2-M; Publisher: alexey.savchenko; Publishing Date: 2/24/2020
R65 = RC0402F-100R-M: as R43 on sheet Control; Value: 100R; PartNumber: RC0402F-100R-M; Publisher: alexey.savchenko; Publishing Date: 2/24/2020
R66 = RC0402F-33K-M: Chip resistor; Manufacturer PN: RC0402FR-0733KL; Manufacturer: Yageo; Tollerance: 1%; Rated Voltage: 50V; Power: 0.063W; T Coefficient: 100ppm; Value: 33k; PartNumber: RC0402F-33K-M; Publisher: alexey.savchenko; Publishing Date: 2/24/2020
R67 = RC0402F-6K04-M: Chip resistor; Manufacturer PN: RC0402FR-076K04L; Manufacturer: Yageo; Tollerance: 1%; Rated Voltage: 50V; Power: 0.063W; T Coefficient: 100ppm; Value: 6.04k; PartNumber: RC0402F-6K04-M; Publisher: alexey.savchenko; Publishing Date: 2/24/2020
R83 = RC0402F-10R-M: as R72 on sheet Control; Value: 10R; PartNumber: RC0402F-10R-M; Publisher: alexey.savchenko; Publishing Date: 2/24/2020
R102 = RC0402F-91R-M: as R12 on sheet Expanders; Value: 91R; PartNumber: RC0402F-91R-M; Publisher: alexey.savchenko; Publishing Date: 2/24/2020
U2 = SN74LV4051AQPWRQ1: 1 Circuit IC Switch 8:1 75Ohm 16-TSSOP; Manufacturer: TI; Analogs: SN74LV4051ATPWRQ1; PartNumber: SN74LV4051AQPWRQ1; Manufacturer PN: SN74LV4051AQPWRQ1; Case: TSSOP-16; Publisher: alexey.savchenko; Publishing Date: 12/9/2020
U3 = TLV172IDBVR: General Purpose Amplifier 1 Circuit Rail-to-Rail SOT-23-5; Manufacturer: TI; PartNumber: TLV172IDBVR; Manufacturer PN: TLV172IDBVR; Case: SOT23-5; Publisher: alexey.savchenko; Publishing Date: 12/9/2020
U4 = DAC70501ZDQFT: SINGLE CHAN DAC 14BIT- ZEROCODE; Manufacturer: TI; Analogs: DAC70501MDQFR, DAC70501MDQFT, DAC70501ZDQFR; PartNumber: DAC70501ZDQFT; Manufacturer PN: DAC70501ZDQFT; Case: WSON-8; Publisher: alexey.savchenko; Publishing Date: 1/13/2020
U19 = LM61460-Q1: Buck Switching Regulator IC Positive Adjustable 1V 1 Output 6A 14-VFQFN; Manufacturer PN: LM61460AASQRJRRQ1; Manufacturer: TI; PartNumber: LM61460-Q1; Case: VQFN-HR-14; Publisher: alexey.savchenko; Publishing Date: 3/27/2020
U20 = AT30TSE002B-MAH-T: Temperature Sensor Digital, Local -20°C ~ 125°C 10 b 8-WDFN (2x3); Manufacturer: Microchip; PartNumber: AT30TSE002B-MAH-T; Manufacturer PN: AT30TSE002B-MAH-T; Case: WDFN-8; Publisher: alexey.savchenko; Publishing Date: 3/31/2020
U21 = MCP65R41T-2402E/CHY: IC COMPARATOR 2.4V REF SOT-23-6; Manufacturer: Microchip; PartNumber: MCP65R41T-2402E/CHY; Manufacturer PN: MCP65R41T-2402E/CHY; Case: SOT23-6; Publisher: alexey.savchenko; Publishing Date: 12/9/2020
X1 = NETs_CONNECTOR: as X3 on sheet Control; PartNumber: NETs_CONNECTOR; Manufacturer: NULL; Publisher: alexey.savchenko; Publishing Date: 2/14/2020
XP1 = TBH-2x3.81P-RA-GN: 2 Position Terminal Block Header, Male Pins, Shrouded (4 Side) 0.150" (3.81mm) 90°, Right Angle Through Hole; Manufacturer PN: 691322310002+691361300002(Plug); Manufacturer: Würth Elektronik; PartNumber: TBH-2x3.81P-RA-GN; Publisher: alexey.savchenko; Publishing Date: 2/14/2020
XP2 = 0447690401: as XP3 on sheet Control; PartNumber: 0447690401; Manufacturer PN: 0447690401; Publisher: alexey.savchenko; Publishing Date: 2/14/2020

## Sheet VoltageFeedbackSwitch.SchDoc
size A3
Used 2 times, as channels Designator/F1, Designator/F2. Parts and nets are listed once, with the designators drawn on the sheet.
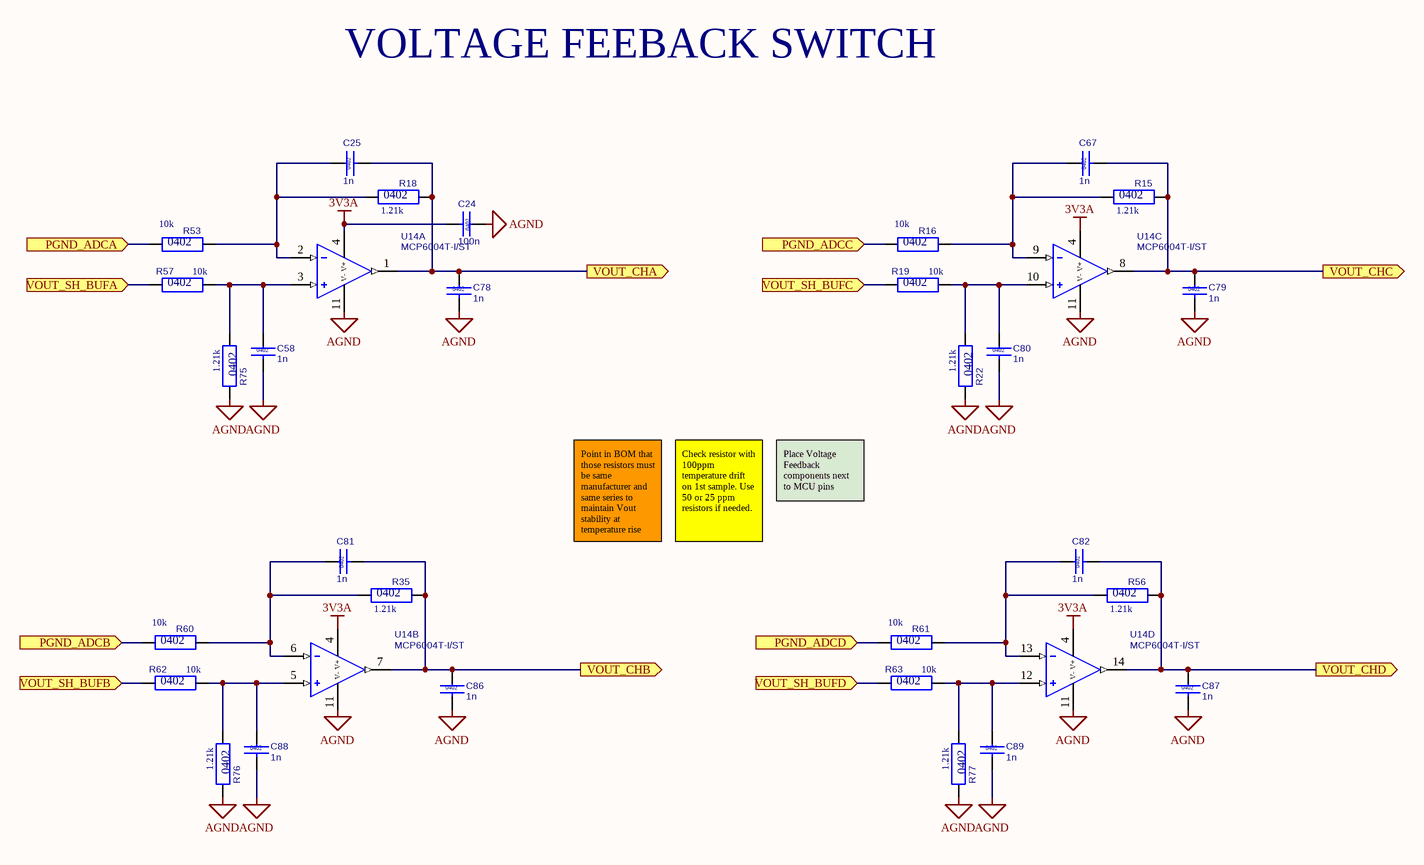
[diagram p4: VoltageFeedbackSwitch.SchDoc]

### Parts
C24  100n  Case: 0402  [CC0402M]
C25  1n  Case: 0402  [CC0402M]
C58  1n  Case: 0402  [CC0402M]
C67  1n  Case: 0402  [CC0402M]
C78  1n  Case: 0402  [CC0402M]
C79  1n  Case: 0402  [CC0402M]
C80  1n  Case: 0402  [CC0402M]
C81  1n  Case: 0402  [CC0402M]
C82  1n  Case: 0402  [CC0402M]
C86  1n  Case: 0402  [CC0402M]
C87  1n  Case: 0402  [CC0402M]
C88  1n  Case: 0402  [CC0402M]
C89  1n  Case: 0402  [CC0402M]
R15  Case: 0402  [RC0402M]  (hidden comment: 1.21k)
R16  Case: 0402  [RC0402M]  (hidden comment: 10k)
R18  Case: 0402  [RC0402M]  (hidden comment: 1.21k)
R19  Case: 0402  [RC0402M]  (hidden comment: 10k)
R22  Case: 0402  [RC0402M]  (hidden comment: 1.21k)
R35  Case: 0402  [RC0402M]  (hidden comment: 1.21k)
R53  Case: 0402  [RC0402M]  (hidden comment: 10k)
R56  Case: 0402  [RC0402M]  (hidden comment: 1.21k)
R57  Case: 0402  [RC0402M]  (hidden comment: 10k)
R60  Case: 0402  [RC0402M]  (hidden comment: 10k)
R61  Case: 0402  [RC0402M]  (hidden comment: 10k)
R62  Case: 0402  [RC0402M]  (hidden comment: 10k)
R63  Case: 0402  [RC0402M]  (hidden comment: 10k)
R75  Case: 0402  [RC0402M]  (hidden comment: 1.21k)
R76  Case: 0402  [RC0402M]  (hidden comment: 1.21k)
R77  Case: 0402  [RC0402M]  (hidden comment: 1.21k)
U14  MCP6004T-I/ST  [TSSOP-14]  (parts A,B,C,D of 4)

### Ports
PGND_ADCA (in), PGND_ADCB (in), PGND_ADCC (in), PGND_ADCD (in), VOUT_CHA (out), VOUT_CHB (out), VOUT_CHC (out), VOUT_CHD (out), VOUT_SH_BUFA (in), VOUT_SH_BUFB (in), VOUT_SH_BUFC (in), VOUT_SH_BUFD (in)

### Nets
3V3A: C24.2 U14.4(V+)
AGND: C24.1 C58.2 C78.2 C79.2 C80.2 C86.2 C87.2 C88.2 C89.2 R22.1 R75.1 R76.1 R77.1 U14.11(V-)
PGND_ADCA: R53.2 ; port PGND_ADCA
PGND_ADCB: R60.2 ; port PGND_ADCB
PGND_ADCC: R16.2 ; port PGND_ADCC
PGND_ADCD: R61.2 ; port PGND_ADCD
VOUT_CHA: C25.2 C78.1 R18.1 U14.1(OUT1) ; port VOUT_CHA
VOUT_CHB: C81.2 C86.1 R35.1 U14.7(OUT2) ; port VOUT_CHB
VOUT_CHC: C67.2 C79.1 R15.1 U14.8(OUT3) ; port VOUT_CHC
VOUT_CHD: C82.2 C87.1 R56.1 U14.14(OUT4) ; port VOUT_CHD
VOUT_SH_BUFA: R57.2 ; port VOUT_SH_BUFA
VOUT_SH_BUFB: R62.2 ; port VOUT_SH_BUFB
VOUT_SH_BUFC: R19.2 ; port VOUT_SH_BUFC
VOUT_SH_BUFD: R63.2 ; port VOUT_SH_BUFD
NetC25_1: C25.1 R18.2 R53.1 U14.2(IN1-)
NetC58_1: C58.1 R57.1 R75.2 U14.3(IN1+)
NetC67_1: C67.1 R15.2 R16.1 U14.9(IN3-)
NetC80_1: C80.1 R19.1 R22.2 U14.10(IN3+)
NetC81_1: C81.1 R35.2 R60.1 U14.6(IN2-)
NetC82_1: C82.1 R56.2 R61.1 U14.13(IN4-)
NetC88_1: C88.1 R62.1 R76.2 U14.5(IN2+)
NetC89_1: C89.1 R63.1 R77.2 U14.12(IN4+)

### Channels
Designator/F1: designators end in _F1; ports PGND_ADCA=PGND_ADC1 PGND_ADCB=PGND_ADC3 PGND_ADCC=PGND_ADC4 PGND_ADCD=PGND_ADC2 VOUT_CHA=VOUT_CH1 VOUT_CHB=VOUT_CH3 VOUT_CHC=VOUT_CH4 VOUT_CHD=VOUT_CH2 VOUT_SH_BUFA=VOUT_SH_BUF1 VOUT_SH_BUFB=VOUT_SH_BUF3 VOUT_SH_BUFC=VOUT_SH_BUF4 VOUT_SH_BUFD=VOUT_SH_BUF2
Designator/F2: designators end in _F2; ports PGND_ADCA=PGND_ADC6 PGND_ADCB=PGND_ADC7 PGND_ADCC=PGND_ADC8 PGND_ADCD=PGND_ADC5 VOUT_CHA=VOUT_CH6 VOUT_CHB=VOUT_CH7 VOUT_CHC=VOUT_CH8 VOUT_CHD=VOUT_CH5 VOUT_SH_BUFA=VOUT_SH_BUF6 VOUT_SH_BUFB=VOUT_SH_BUF7 VOUT_SH_BUFC=VOUT_SH_BUF8 VOUT_SH_BUFD=VOUT_SH_BUF5

### Notes on the sheet
- VOLTAGE FEEBACK SWITCH
- Point in BOM that those resistors must be same manufacturer and same series to maintain Vout stability at temperature rise
- Check resistor with 100ppm temperature drift on 1st sample. Use 50 or 25 ppm resistors if needed.
- Place Voltage Feedback components next to MCU pins

### Library data of the parts
C24 = CC0402K-X7R-25V-100N-M: as C1 on sheet Control; PartNumber: CC0402K-X7R-25V-100N-M; Value: 100n; Publisher: alexey.savchenko; Publishing Date: 1/12/2020
C25 C58 C67 C80-C82 C88 C89 = CC0402J-NP0-50V-1N-M: Chip ceramic capacitor; Manufacturer PN: CL05C102JB5NNNC; Manufacturer: Samsung; Tollerance: 5%; Rated Voltage: 50V; Material: NP0; PartNumber: CC0402J-NP0-50V-1N-M; Value: 1n; Publisher: alexey.savchenko; Publishing Date: 2/27/2020
C78 C79 C86 C87 = CC0402K-X7R-50V-1N-M: as C23 on sheet Control; PartNumber: CC0402K-X7R-50V-1N-M; Value: 1n; Publisher: alexey.savchenko; Publishing Date: 2/27/2020
R15 R18 R22 R35 R56 R75-R77 = RC0402F-1K21-M: Chip resistor; Manufacturer PN: RC0402FR-071K21L; Manufacturer: Yageo; Tollerance: 1%; Rated Voltage: 50V; Power: 0.063W; T Coefficient: 100ppm; Value: 1.21k; PartNumber: RC0402F-1K21-M; Publisher: alexey.savchenko; Publishing Date: 12/7/2020
R16 R19 R53 R57 R60-R63 = RC0402F-10K-M: Chip resistor; Manufacturer PN: RC0402FR-0710KL; Manufacturer: Yageo; Tollerance: 1%; Rated Voltage: 50V; Power: 0.063W; Value: 10k; PartNumber: RC0402F-10K-M; Publisher: alexey.savchenko; Publishing Date: 2/24/2020
U14 = MCP6004T-I/ST: General Purpose Amplifier 4 Circuit Rail-to-Rail 14-TSSOP; Manufacturer: Microchip; PartNumber: MCP6004T-I/ST; Manufacturer PN: MCP6004T-I/ST; Case: TSSOP-14; Publisher: alexey.savchenko; Publishing Date: 4/9/2020